# EAGLE design PTG (EAGLE 7.7.0)

## Sheet 1 of 2
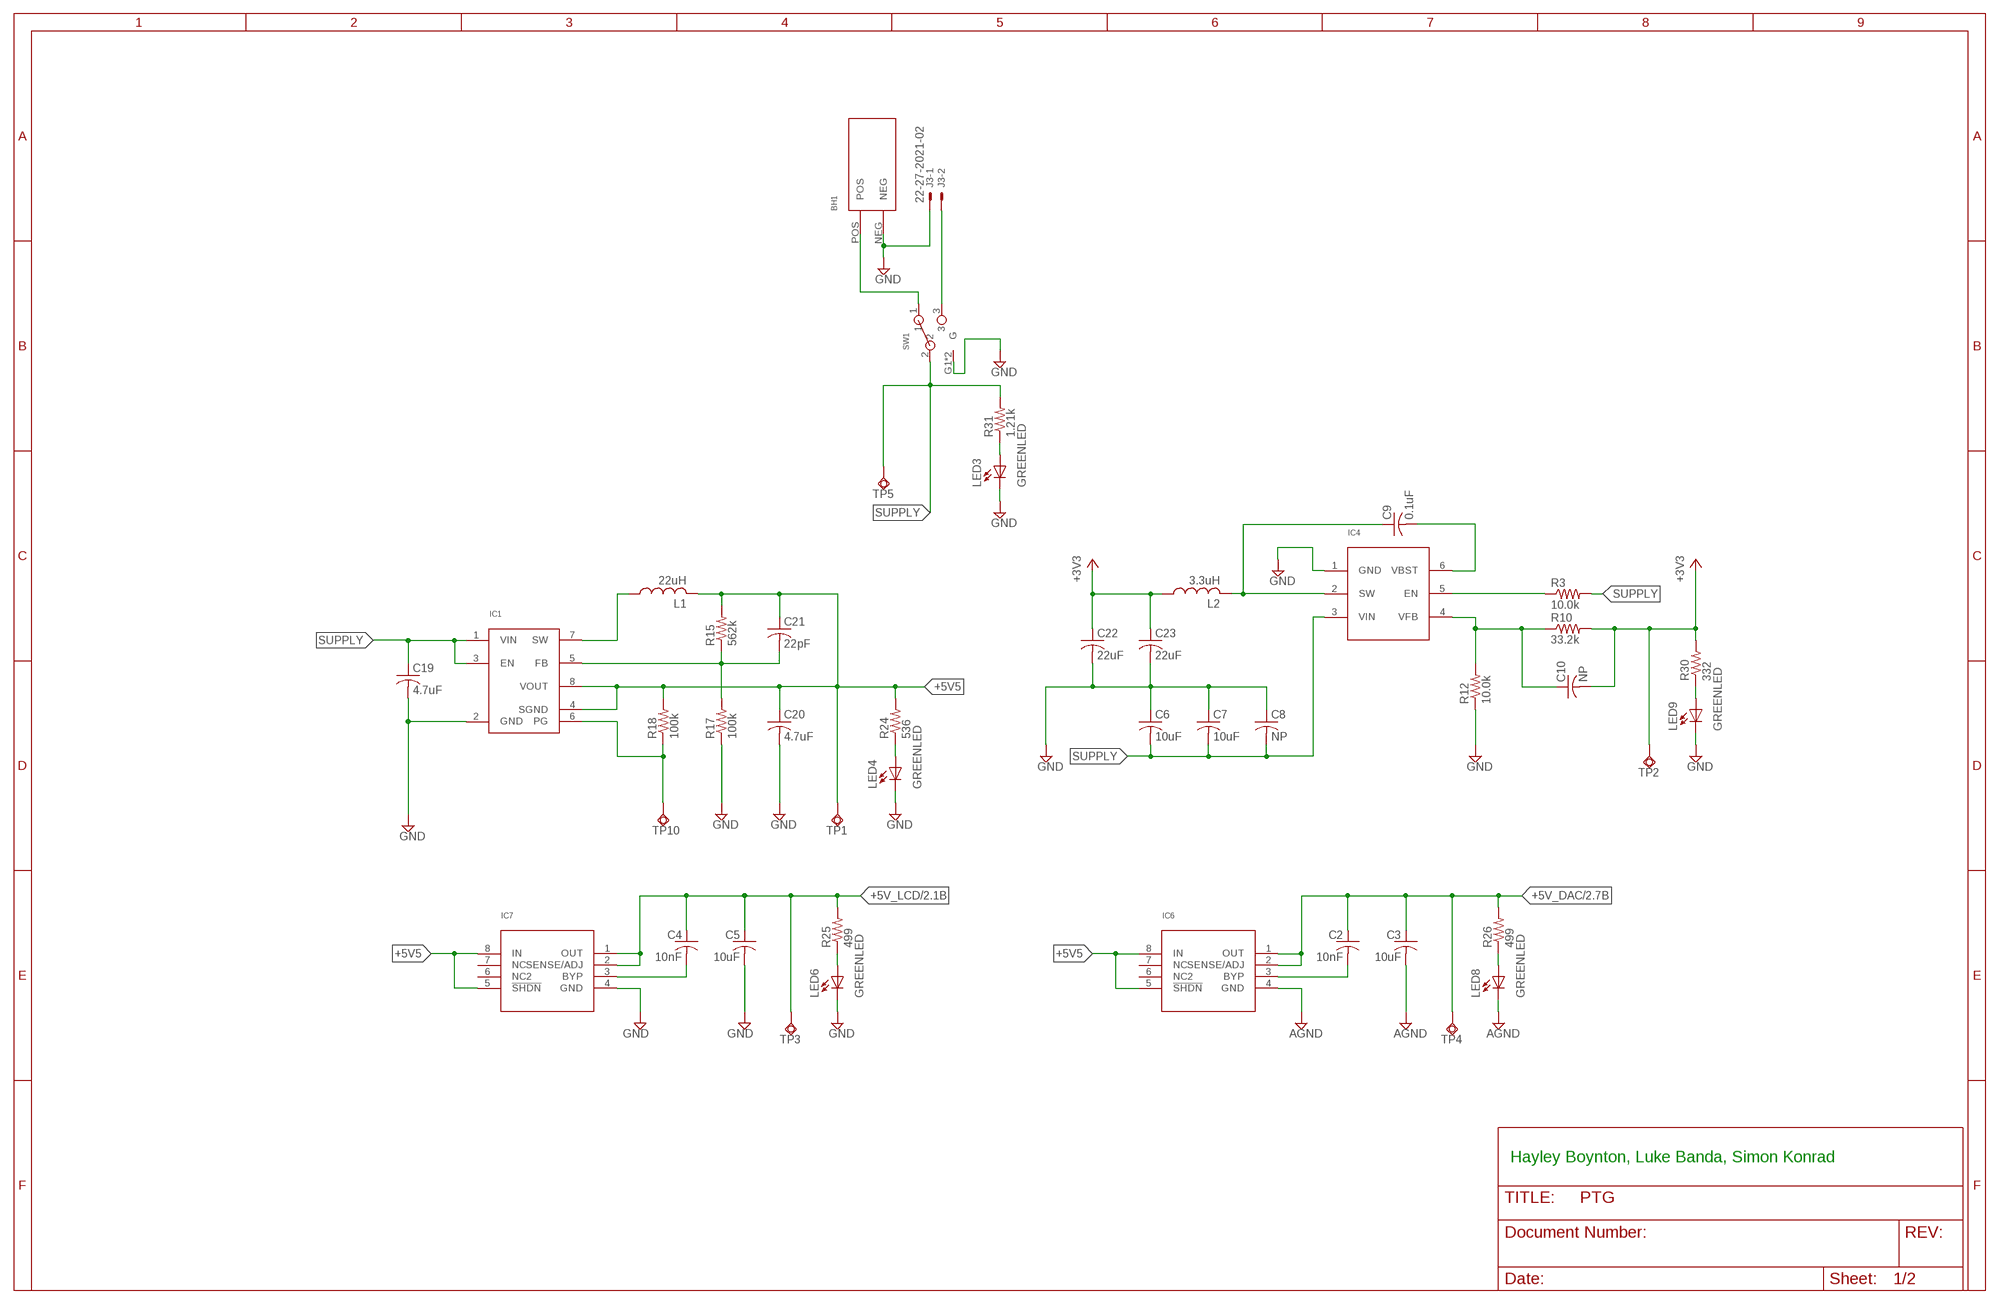
[diagram p0: schematic, sheet 1]

### Parts
BH1  BATTERY_HOLDER  [BATTERY_HOLDER]
C2  10nF  C-USC0603K  [C0603K]
C3  10uF  C-USC0805K  [C0805K]
C4  10nF  C-USC0603K  [C0603K]
C5  10uF  C-USC0805K  [C0805K]
C6  10uF  C-USC0805K  [C0805K]
C7  10uF  C-USC0805K  [C0805K]
C8  NP  C-USC0805K  [C0805K]
C9  0.1uF  C-USC0603K  [C0603K]
C10  NP  C-USC0603K  [C0603K]
C19  4.7uF  C-USC0805K  [C0805K]
C20  4.7uF  C-USC0805K  [C0805K]
C21  22pF  C-USC0603K  [C0603K]
C22  22uF  C-USC0805K  [C0805K]
C23  22uF  C-USC0805K  [C0805K]
IC1  TPS62120  [SOT23(8)]
IC4  TPS561208  [SOT6]
IC6  LT1762  [MS8]
IC7  LT1762  [MS8]
J3  22-27-2021-02  [6410-02]
L1  22uH  VLCF4020_INDUCTOR  [VLCF4020]
L2  3.3uH  VLCF4020_INDUCTOR  [VLCF4020]
LED3  GREENLED  [0805_10MGAP]
LED4  GREENLED  [0805_10MGAP]
LED6  GREENLED  [0805_10MGAP]
LED8  GREENLED  [0805_10MGAP]
LED9  GREENLED  [0805_10MGAP]
R3  10.0k  R-US_R0603  [R0603]
R10  33.2k  R-US_R0603  [R0603]
R12  10.0k  R-US_R0603  [R0603]
R15  562k  R-US_R0603  [R0603]
R17  100k  R-US_R0603  [R0603]
R18  100k  R-US_R0603  [R0603]
R24  536  R-US_R0603  [R0603]
R25  499  R-US_R0603  [R0603]
R26  499  R-US_R0603  [R0603]
R30  332  R-US_R0603  [R0603]
R31  1.21k  R-US_R0603  [R0603]
SW1  ROCKER_SWITCH  [ROCKER_SWITCH]
TP1  TPSQTP20SQD  [TP20SQD]
TP2  TPSQTP20SQD  [TP20SQD]
TP3  TPSQTP20SQD  [TP20SQD]
TP4  TPSQTP20SQD  [TP20SQD]
TP5  TPSQTP20SQD  [TP20SQD]
TP10  TPSQTP20SQD  [TP20SQD]

### Nets
+3V3: C10.2 C22.1 C23.1 L2.1 R10.2 R30.2 TP2.1(TP) TP2.TP ; also sheet 2
+5V5: C20.1 C21.1 IC1.4(SGND) IC1.8(VOUT) IC6.5(!SHDN) IC6.8(IN) IC7.5(!SHDN) IC7.8(IN) L1.2 R15.2 R18.2 R24.2 TP1.1(TP) TP1.TP
+5V_DAC: C2.1 C3.1 IC6.1(OUT) IC6.2(SENSE/ADJ) R26.2 TP4.1(TP) TP4.TP ; also sheet 2
+5V_LCD: C4.1 C5.1 IC7.1(OUT) IC7.2(SENSE/ADJ) R25.2 TP3.1(TP) TP3.TP ; also sheet 2
AGND: C3.2 IC6.4(GND) LED8.1(-) ; also sheet 2
GND: BH1.NEG C5.2 C6.1 C7.1 C8.1 C19.2 C20.2 C22.2 C23.2 IC1.2(GND) IC4.1(GND) IC7.4(GND) J3.1 LED3.1(-) LED4.1(-) LED6.1(-) LED9.1(-) R12.1 R17.1 SW1.G1(G) SW1.G2(G) ; also sheet 2
N$2: C10.1 IC4.4(VFB) R10.1 R12.2
N$4: C9.1 IC4.2(SW) L2.2
N$5: C9.2 IC4.6(VBST)
N$6: IC4.5(EN) R3.1
N$7: IC1.7(SW) L1.1
N$8: C21.2 IC1.5(FB) R15.1 R17.2
N$9: C2.2 IC6.3(BYP)
N$13: LED3.2(+) R31.1
N$22: LED4.2(+) R24.1
N$23: C4.2 IC7.3(BYP)
N$24: LED6.2(+) R25.1
N$26: LED8.2(+) R26.1
N$28: LED9.2(+) R30.1
N$29: BH1.POS SW1.1
N$30: J3.2 SW1.3
PWRGOOD: IC1.6(PG) R18.1 TP10.1(TP) TP10.TP
SUPPLY: C6.2 C7.2 C8.2 C19.1 IC1.1(VIN) IC1.3(EN) IC4.3(VIN) R3.2 R31.2 SW1.2 TP5.1(TP) TP5.TP
Unconnected: IC6.6(NC2) IC6.7(NC) IC7.6(NC2) IC7.7(NC)

### Notes on the sheet
- Hayley Boynton, Luke Banda, Simon Konrad

## Sheet 2 of 2
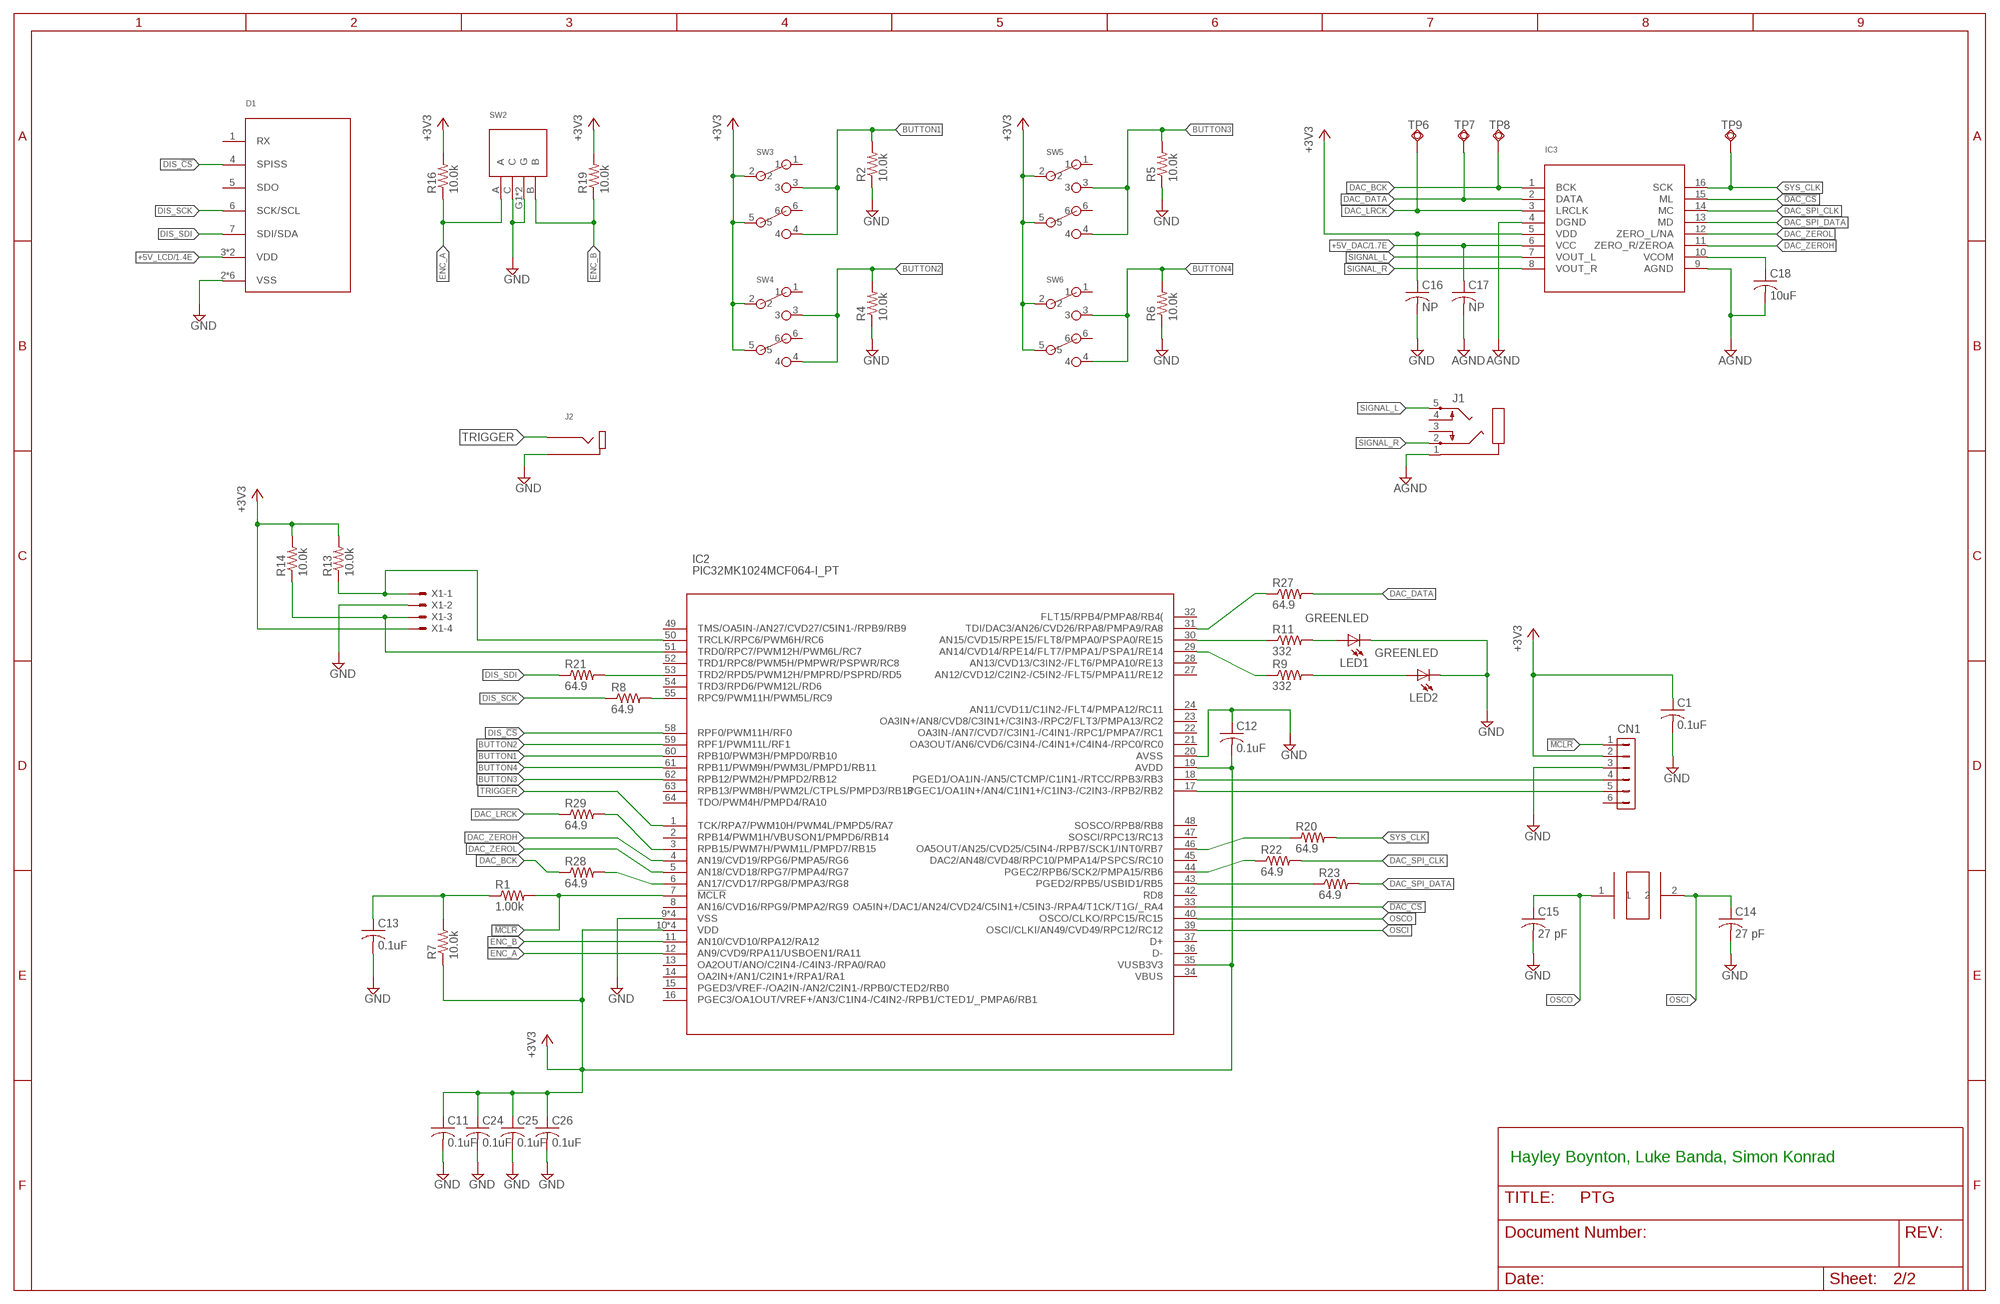
[diagram p1: schematic, sheet 2]

### Parts
C1  0.1uF  C-USC0603K  [C0603K]
C11  0.1uF  C-USC0603K  [C0603K]
C12  0.1uF  C-USC0603K  [C0603K]
C13  0.1uF  C-USC0603K  [C0603K]
C14  27 pF  C-USC0603K  [C0603K]
C15  27 pF  C-USC0603K  [C0603K]
C16  NP  C-USC0603K  [C0603K]
C17  NP  C-USC0603K  [C0603K]
C18  10uF  C-USC0805K  [C0805K]
C24  0.1uF  C-USC0603K  [C0603K]
C25  0.1uF  C-USC0603K  [C0603K]
C26  0.1uF  C-USC0603K  [C0603K]
CN1  HDR-1X6-SIP-100  [SIP-100-6V]
D1  NHD-0216K3Z-GBW-V3  [NHD-0216K3Z-FL-GBW-V3]
IC2  PIC32MK1024MCF064-I_PT  [TQFP64-10X10]
IC3  PCM1748  [SSOP]
J1  STX31005NB  [STX31005NB]
J2  RCJ-01X  [RCJ-01X]
LED1  GREENLED  [0805_10MGAP]
LED2  GREENLED  [0805_10MGAP]
R1  1.00k  R-US_R0603  [R0603]
R2  10.0k  R-US_R0603  [R0603]
R4  10.0k  R-US_R0603  [R0603]
R5  10.0k  R-US_R0603  [R0603]
R6  10.0k  R-US_R0603  [R0603]
R7  10.0k  R-US_R0603  [R0603]
R8  64.9  R-US_R0603  [R0603]
R9  332  R-US_R0603  [R0603]
R11  332  R-US_R0603  [R0603]
R13  10.0k  R-US_R0603  [R0603]
R14  10.0k  R-US_R0603  [R0603]
R16  10.0k  R-US_R0603  [R0603]
R19  10.0k  R-US_R0603  [R0603]
R20  64.9  R-US_R0603  [R0603]
R21  64.9  R-US_R0603  [R0603]
R22  64.9  R-US_R0603  [R0603]
R23  64.9  R-US_R0603  [R0603]
R27  64.9  R-US_R0603  [R0603]
R28  64.9  R-US_R0603  [R0603]
R29  64.9  R-US_R0603  [R0603]
SW2  ENCODER  [EC12E24204A7]
SW3  MHPS2273N  [MHPS2273N]
SW4  MHPS2273N  [MHPS2273N]
SW5  MHPS2273N  [MHPS2273N]
SW6  MHPS2273N  [MHPS2273N]
TP6  TPSQTP20SQD  [TP20SQD]
TP7  TPSQTP20SQD  [TP20SQD]
TP8  TPSQTP20SQD  [TP20SQD]
TP9  TPSQTP20SQD  [TP20SQD]
X1  22-23-2041  [22-23-2041]
Y1  EXTERNALCRYSTAL  [XTAL500X320X130N]

### Nets
!DAC_CS: IC2.33(OA5IN+/DAC1/AN24/CVD24/C5IN1+/C5IN3-/RPA4/T1CK/T1G/_RA4) IC3.15(ML)
!MCLR: CN1.1 IC2.7(!MCLR) R1.2
+3V3: C1.1 C11.1 C12.2 C16.1 C24.1 C25.1 C26.1 CN1.2 IC2.10(VDD) IC2.19(AVDD) IC2.26(VDD) IC2.35(VUSB3V3) IC2.38(VDD) IC2.57(VDD) IC3.5(VDD) R7.1 R13.2 R14.2 R16.2 R19.2 SW3.2 SW3.5 SW4.2 SW4.5 SW5.2 SW5.5 SW6.2 SW6.5 X1.4 ; also sheet 1
+5V_DAC: C17.1 IC3.6(VCC) ; also sheet 1
+5V_LCD: D1.3(VDD) D1.9(VDD) ; also sheet 1
AGND: C17.2 C18.2 IC3.4(DGND) IC3.9(AGND) J1.1 ; also sheet 1
BUTTON1: IC2.60(RPB10/PWM3H/PMPD0/RB10) R2.2 SW3.3 SW3.4
BUTTON2: IC2.59(RPF1/PWM11L/RF1) R4.2 SW4.3 SW4.4
BUTTON3: IC2.62(RPB12/PWM2H/PMPD2/RB12) R5.2 SW5.3 SW5.4
BUTTON4: IC2.61(RPB11/PWM9H/PWM3L/PMPD1/RB11) R6.2 SW6.3 SW6.4
DAC_BCK: IC3.1(BCK) R28.1 TP8.1(TP) TP8.TP
DAC_DATA: IC3.2(DATA) R27.2 TP7.1(TP) TP7.TP
DAC_LRCK: IC3.3(LRCLK) R29.1 TP6.1(TP) TP6.TP
DAC_SPI_CLK: IC3.14(MC) R22.2
DAC_SPI_DATA: IC3.13(MD) R23.2
DAC_ZEROH: IC2.4(AN19/CVD19/RPG6/PMPA5/RG6) IC3.11(ZERO_R/ZEROA)
DAC_ZEROL: IC2.5(AN18/CVD18/RPG7/PMPA4/RG7) IC3.12(ZERO_L/NA)
DIS_!CS: D1.4(SPISS) IC2.58(RPF0/PWM11H/RF0)
DIS_SCK: D1.6(SCK/SCL) R8.1
DIS_SDI: D1.7(SDI/SDA) R21.1
ENC_A: IC2.12(AN9/CVD9/RPA11/USBOEN1/RA11) R16.1 SW2.A
ENC_B: IC2.11(AN10/CVD10/RPA12/RA12) R19.1 SW2.B
GND: C1.2 C11.2 C12.1 C13.2 C14.2 C15.2 C16.2 C24.2 C25.2 C26.2 CN1.3 D1.2(VSS) D1.8(VSS) D1.G1(VSS) D1.G2(VSS) D1.G3(VSS) D1.G4(VSS) IC2.9(VSS) IC2.20(AVSS) IC2.25(VSS) IC2.41(VSS) IC2.56(VSS) J2.1 J2.3 J2.4 LED1.1(-) LED2.1(-) R2.1 R4.1 R5.1 R6.1 SW2.C SW2.G1(G) SW2.G2(G) X1.2 ; also sheet 1
N$1: IC2.31(TDI/DAC3/AN26/CVD26/RPA8/PMPA9/RA8) R27.1
N$3: IC2.55(RPC9/PWM11H/PWM5L/RC9) R8.2
N$10: IC2.53(TRD2/RPD5/PWM12H/PMPRD/PSPRD/RD5) R21.2
N$11: IC2.30(AN15/CVD15/RPE15/FLT8/PMPA0/PSPA0/RE15) R11.1
N$12: LED1.2(+) R11.2
N$14: IC2.46(OA5OUT/AN25/CVD25/C5IN4-/RPB7/SCK1/INT0/RB7) R20.1
N$15: LED2.2(+) R9.2
N$16: CN1.5 IC2.17(PGEC1/OA1IN+/AN4/C1IN1+/C1IN3-/C2IN3-/RPB2/RB2)
N$17: IC2.29(AN14/CVD14/RPE14/FLT7/PMPA1/PSPA1/RE14) R9.1
N$18: C13.1 R1.1 R7.2
N$19: C18.1 IC3.10(VCOM)
N$20: IC2.3(RPB15/PWM7H/PWM1L/PMPD7/RB15) R29.2
N$21: IC2.44(PGEC2/RPB6/SCK2/PMPA15/RB6) R22.1
N$25: CN1.4 IC2.18(PGED1/OA1IN-/AN5/CTCMP/C1IN1-/RTCC/RPB3/RB3)
N$27: IC2.43(PGED2/RPB5/USBID1/RB5) R23.1
N$31: IC2.6(AN17/CVD17/RPG8/PMPA3/RG8) R28.2
OSCI: C14.1 IC2.39(OSCI/CLKI/AN49/CVD49/RPC12/RC12) Y1.2
OSCO: C15.1 IC2.40(OSCO/CLKO/RPC15/RC15) Y1.1
SIGNAL_L: IC3.7(VOUT_L) J1.5
SIGNAL_R: IC3.8(VOUT_R) J1.2
SYS_CLK: IC3.16(SCK) R20.2 TP9.1(TP) TP9.TP
TRIGGER: IC2.1(TCK/RPA7/PWM10H/PWM4L/PMPD5/RA7) J2.2
UART-RX: IC2.50(TRCLK/RPC6/PWM6H/RC6) R13.1 X1.1
UART-TX: IC2.51(TRD0/RPC7/PWM12H/PWM6L/RC7) R14.1 X1.3
Unconnected: CN1.6 D1.1(RX) D1.5(SDO) IC2.2(RPB14/PWM1H/VBUSON1/PMPD6/RB14) IC2.8(AN16/CVD16/RPG9/PMPA2/RG9) IC2.13(OA2OUT/ANO/C2IN4-/C4IN3-/RPA0/RA0) IC2.14(OA2IN+/AN1/C2IN1+/RPA1/RA1) IC2.15(PGED3/VREF-/OA2IN-/AN2/C2IN1-/RPB0/CTED2/RB0) IC2.16(PGEC3/OA1OUT/VREF+/AN3/C1IN4-/C4IN2-/RPB1/CTED1/_PMPA6/RB1) IC2.21(OA3OUT/AN6/CVD6/C3IN4-/C4IN1+/C4IN4-/RPC0/RC0) IC2.22(OA3IN-/AN7/CVD7/C3IN1-/C4IN1-/RPC1/PMPA7/RC1) IC2.23(OA3IN+/AN8/CVD8/C3IN1+/C3IN3-/RPC2/FLT3/PMPA13/RC2) IC2.24(AN11/CVD11/C1IN2-/FLT4/PMPA12/RC11) IC2.27(AN12/CVD12/C2IN2-/C5IN2-/FLT5/PMPA11/RE12) IC2.28(AN13/CVD13/C3IN2-/FLT6/PMPA10/RE13) IC2.32(FLT15/RPB4/PMPA8/RB4() IC2.34(VBUS) IC2.36(D-) IC2.37(D+) IC2.42(RD8) IC2.45(DAC2/AN48/CVD48/RPC10/PMPA14/PSPCS/RC10) IC2.47(SOSCI/RPC13/RC13) IC2.48(SOSCO/RPB8/RB8) IC2.49(TMS/OA5IN-/AN27/CVD27/C5IN1-/RPB9/RB9) IC2.52(TRD1/RPC8/PWM5H/PMPWR/PSPWR/RC8) IC2.54(TRD3/RPD6/PWM12L/RD6) IC2.63(RPB13/PWM8H/PWM2L/CTPLS/PMPD3/RB13) IC2.64(TDO/PWM4H/PMPD4/RA10) J1.3 J1.4 SW3.1 SW3.6 SW4.1 SW4.6 SW5.1 SW5.6 SW6.1 SW6.6

### Notes on the sheet
- Hayley Boynton, Luke Banda, Simon Konrad

## Library data of the parts
BH1 = Batt_Holder:BATTERY_HOLDER: 9V Battery Holder Through Holes 4 Mounting Holes
C1-C26 = rcl:C-US: CAPACITOR, American symbol
CN1 = con-hdrs40:HDR-1X6: HEADER CONNECTOR
D1 = NHD-0216K3Z-FL-GBW-V3:NHD-0216K3Z-GBW-V3: NHD-0216K3Z-GBW-V3 Serial Liquid Crystal Display Module 2 Lines x 16 Characters 5 V input
IC1 = TPS62120:TPS62120: TPS62120 2-15V Input 1.2-5.5V Output Highly Efficient Buck Converter DCN PKG
IC2 = PIC_FORREAL:PIC32MK1024MCF064-I_PT: MICROCHIP - PIC32MK1024MCF064-I/PT - MCU, 32BIT, PIC32, 120MHZ, TQFP-64 Source: Datasheet <http://ww1.microchip.com/downloads/en/DeviceDoc/60001402D.pdf>
IC3 = PCM1748:PCM1748: PCM1748 24 Bit 96kHz Sampling DAC 5V Analog input 3.3V Digital Input
IC4 = TPS561208:TPS561208: TPS561208 5V input 3V3 output Step Down Voltage Regulator
IC6 IC7 = LT1762:LT1762: LT1762 150mA Low Noise LDO Regulator 1.8-20V Input 1.22-20V Output
J1 = STX31005NB:STX31005NB: STX31005NB 3.5mm Stereo Jack Single Pole Double Throw
J2 = RCJ-01X:RCJ-01X: RCJ-01X RCA Port
J3 = con-molex:22-?-02: CONNECTOR wire to board 2.54 mm (.1 inch) pitch header; OC_FARNELL: unknown; OC_NEWARK: unknown
L1 L2 = VLCF4020Inductor:VLCF4020_INDUCTOR: VLCF4020 Type Inductors for Power Circuits TDK
LED1-LED4 LED6 LED8 LED9 = GreenLED:GREENLED
R1 R3 R7 R10 R12 R15 R17 R18 R24-R26 R30 R31 = resistor:R-US_: RESISTOR, American symbol
R2 R4-R6 R8 R9 R11 R13 R14 R16 R19-R23 R27-R29 = rcl:R-US_: RESISTOR, American symbol
SW1 = Rocker_Sw:ROCKER_SWITCH: 3 Position Rocker Switch On - Off - On Max 28V DC @5A Side Facing Switch
SW2 = Encoder:ENCODER: EC12E24204A7 12 mm Insulated Shaft Encoder
SW3-SW6 = Button:MHPS2273N: MHPS2273N Momentary Double Pole Double Throw Button 100mA @30V DC
TP1-TP10 = testpad:TPSQ: Test pad
X1 = 22-23-2041:22-23-2041: .100" (2.54mm) Center Header - 4 Pin; AVAILABILITY: Good; DESCRIPTION: KK® 254 Solid Header, Vertical, with Friction Lock, 4 Circuits, Tin _Sn_ Plating; MF: Molex; MP: 22-23-2041; PACKAGE: None; PRICE: 0.14 USD
Y1 = XTAL500X320X130N:EXTERNALCRYSTAL

## Board
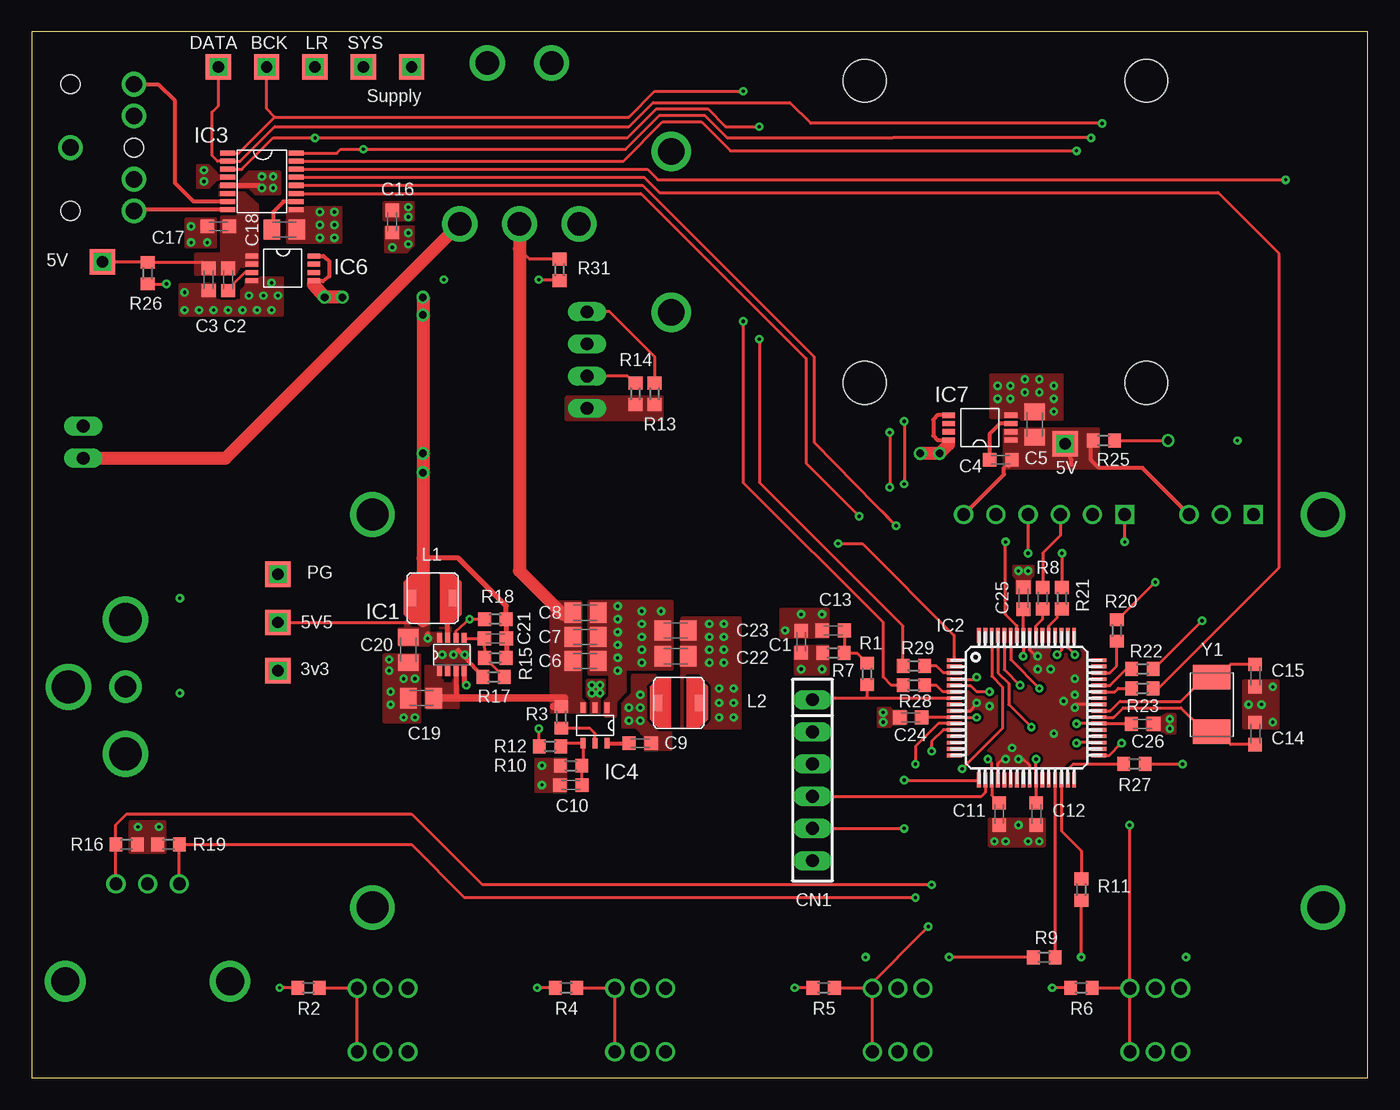
[diagram p2: board, top side]
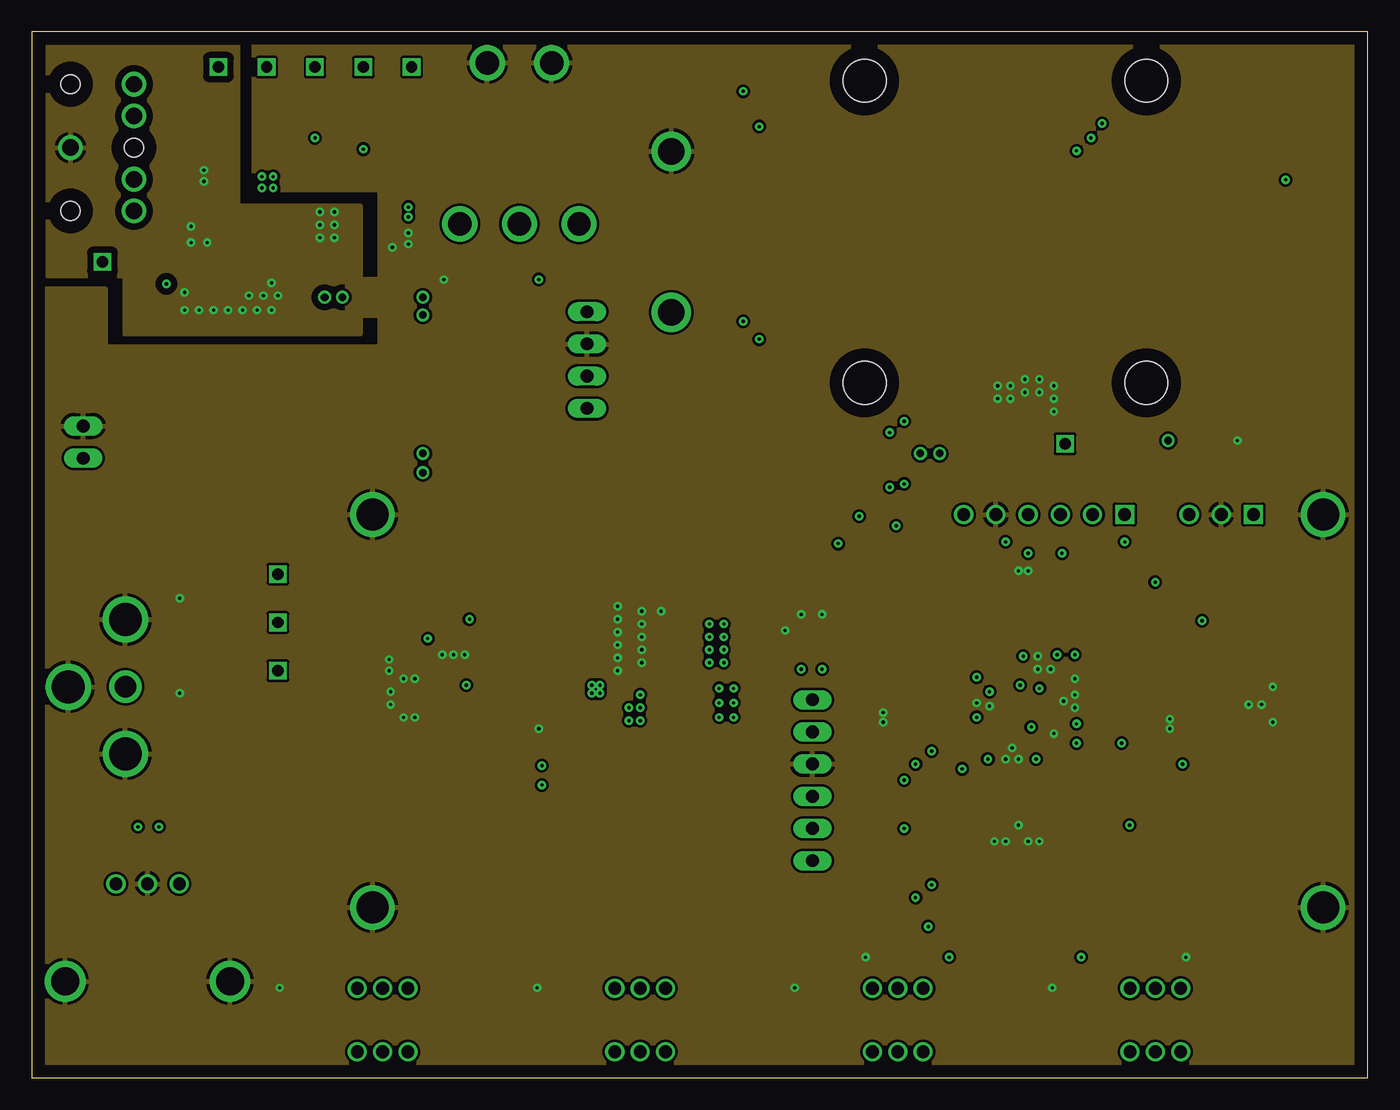
[diagram p3: board, inner layer GND]
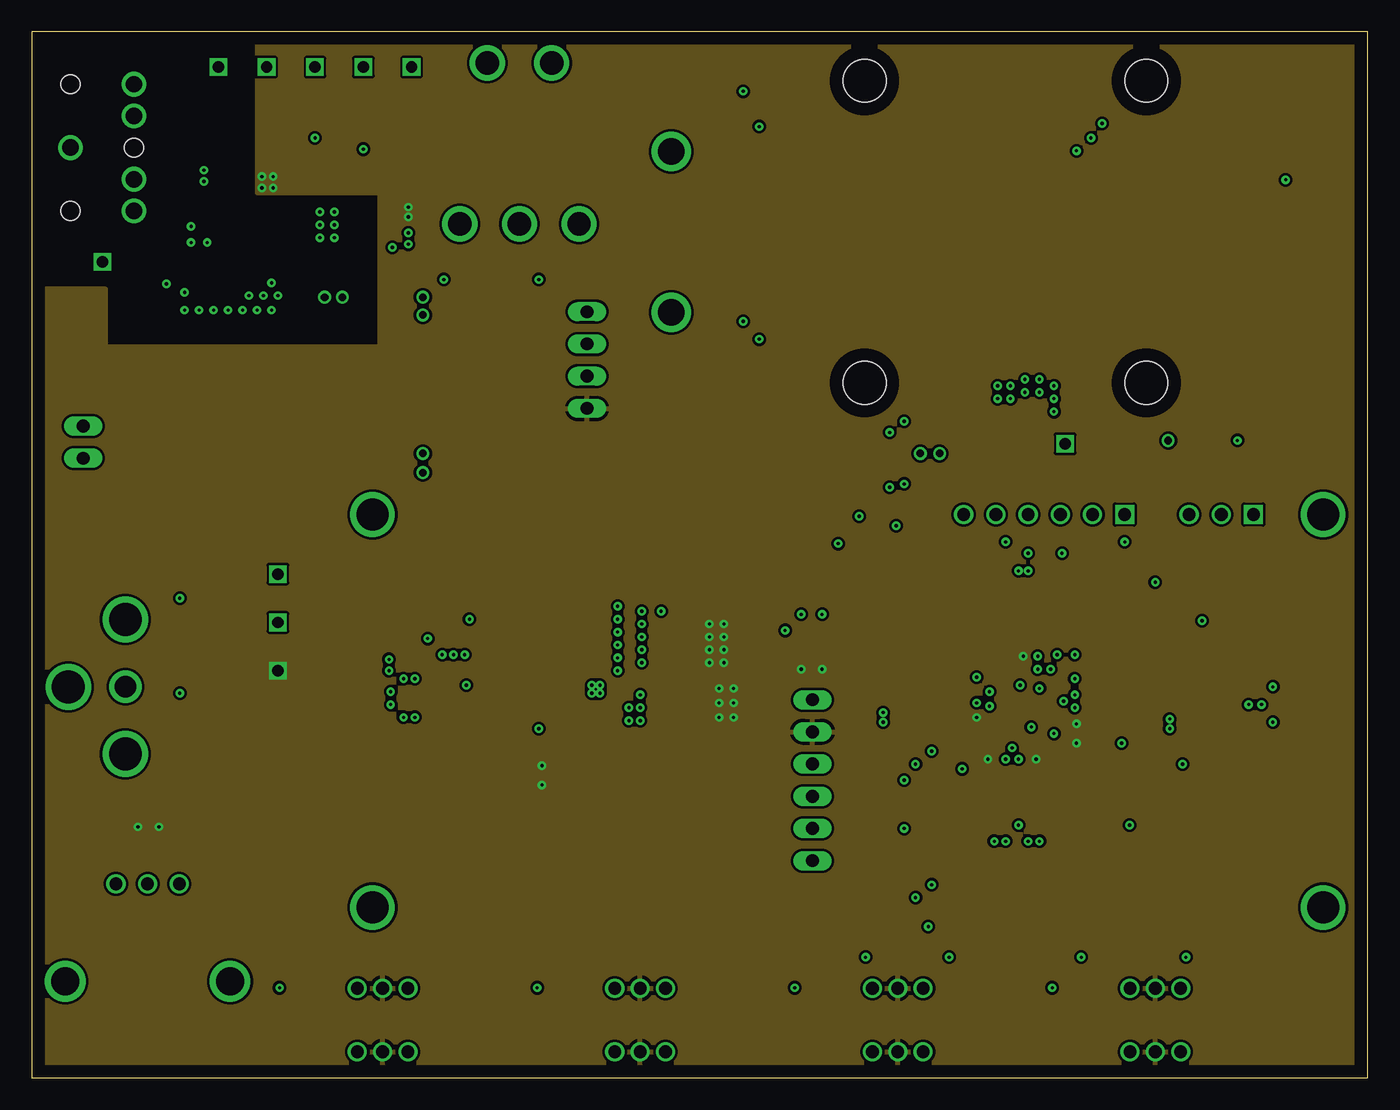
[diagram p4: board, inner layer PWR]
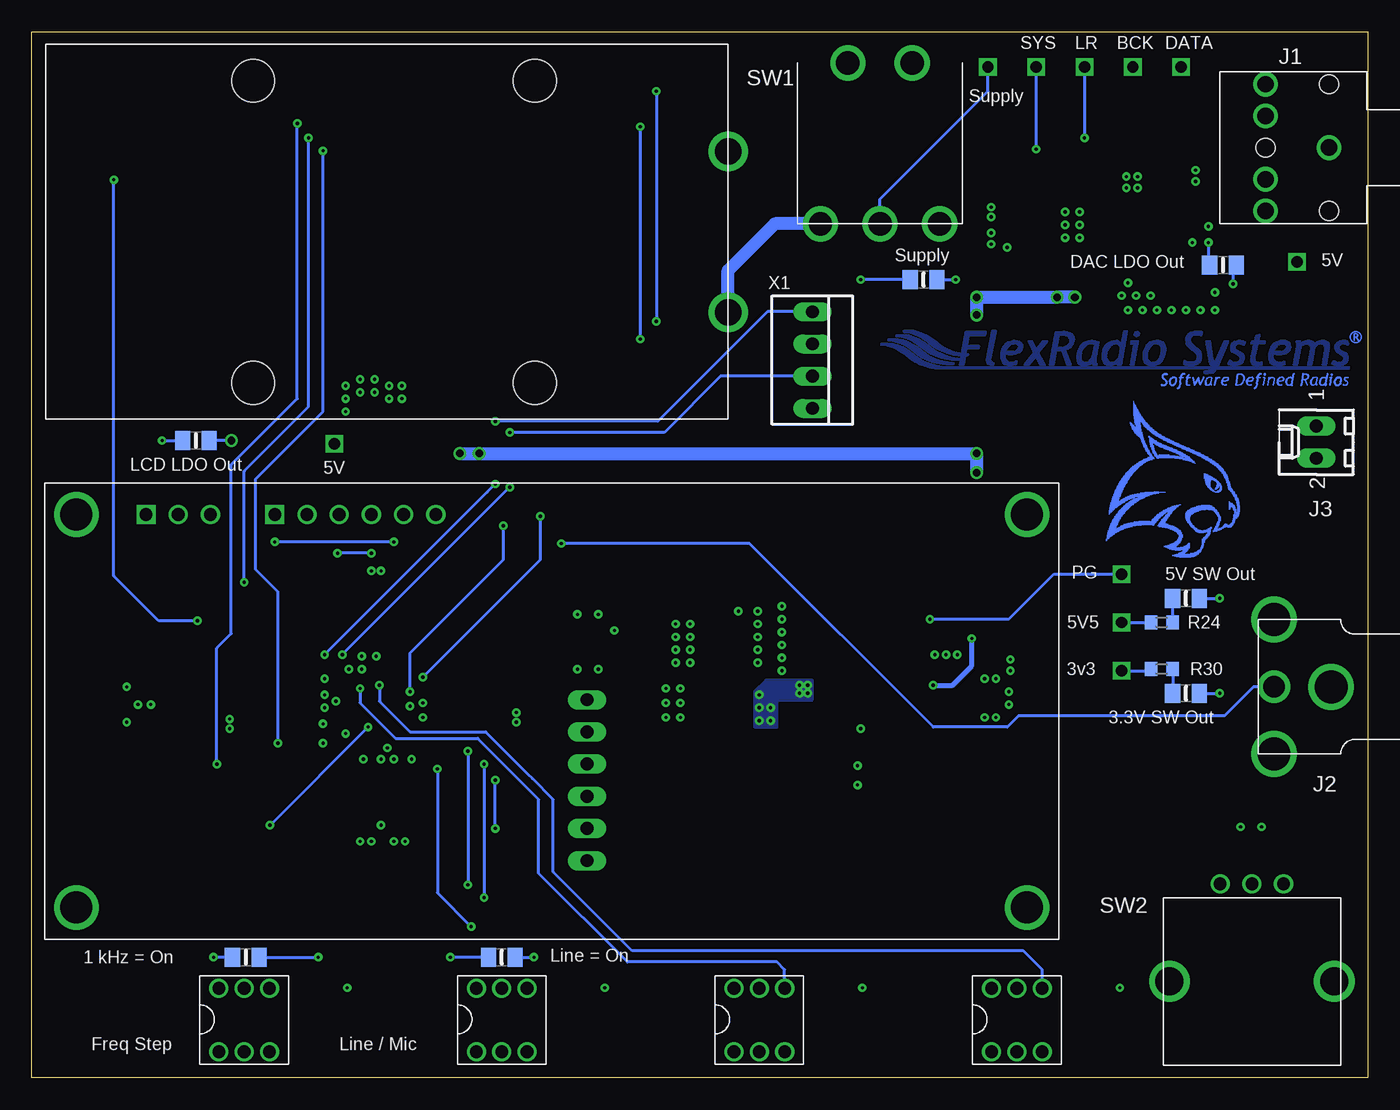
[diagram p5: board, bottom side, seen from below]

Size 105.41 x 82.55 mm. Coordinates in mm from the lower left corner, seen from the top.
Outline: 0,0 105.41,0 105.41,82.55 0,82.55 0,0
Copper layers (1*2*15*16): Top 0.035559375mm / dielectric 9mil / GND 0.035559375mm / dielectric 40mil / PWR 0.035559375mm / dielectric 9mil / Bottom 0.035559375mm
Design rules "default *": minimum track width 10mil, minimum drill 8mil, track to track 8mil, track to pad 8mil, pad to pad 8mil, via to via 8mil, smd to smd 8mil, copper to edge 40mil, drill to drill 8mil, minimum pad ring 10mil, minimum via ring 8mil, stop-mask expansion 4mil, vias tented up to drill 0mil, thermal gap 10mil

### Footprints (pad centres in the part's own frame; a part is rotated, then mirrored left to right if it is on the bottom)
BATTERY_HOLDER = drill 2.1: NEG -27,-6.565; POS -27,6.135 | hole 3.4: -11.76,-12.13; 10.47,-12.13; 10.47,11.7; -11.76,11.7
C0603K = smd 1.05 x 1.08: 1 -0.875,0; 2 0.875,0
C0805K = smd 1.3 x 1.6: 1 -1,0; 2 1,0
SIP-100-6V = drill 1.016 long: 1 -6.35,0; 2 -3.81,0; 3 -1.27,0; 4 1.27,0; 5 3.81,0; 6 6.35,0
NHD-0216K3Z-FL-GBW-V3 = drill 1 square: 1 -32,15.5; 4 -21.84,15.5 | drill 1: 2 -29.46,15.5; 3 -26.92,15.5; 5 -19.3,15.5; 6 -16.76,15.5; 7 -14.22,15.5; 8 -11.68,15.5; 9 -9.14,15.5 | drill 2.5: G1 -37.5,15.5; G2 37.5,15.5; G3 37.5,-15.5; G4 -37.5,-15.5
SOT23(8) = smd 0.4 x 0.8: 1 -0.975,-1.3; 2 -0.325,-1.3; 3 0.325,-1.3; 4 0.975,-1.3; 5 0.975,1.3; 6 0.325,1.3; 7 -0.325,1.3; 8 -0.975,1.3
TQFP64-10X10 = smd 1.2 x 0.3: 1 -5.7,3.75; 2 -5.7,3.25; 3 -5.7,2.75; 4 -5.7,2.25; 5 -5.7,1.75; 6 -5.7,1.25; 7 -5.7,0.75; 8 -5.7,0.25; 9 -5.7,-0.25; 10 -5.7,-0.75; 11 -5.7,-1.25; 12 -5.7,-1.75; 13 -5.7,-2.25; 14 -5.7,-2.75; 15 -5.7,-3.25; 16 -5.7,-3.75; 33 5.7,-3.75; 34 5.7,-3.25; 35 5.7,-2.75; 36 5.7,-2.25; 37 5.7,-1.75; 38 5.7,-1.25; 39 5.7,-0.75; 40 5.7,-0.25; 41 5.7,0.25; 42 5.7,0.75; 43 5.7,1.25; 44 5.7,1.75; 45 5.7,2.25; 46 5.7,2.75; 47 5.7,3.25; 48 5.7,3.75 | smd 0.3 x 1.2: 17 -3.75,-5.7; 18 -3.25,-5.7; 19 -2.75,-5.7; 20 -2.25,-5.7; 21 -1.75,-5.7; 22 -1.25,-5.7; 23 -0.75,-5.7; 24 -0.25,-5.7; 25 0.25,-5.7; 26 0.75,-5.7; 27 1.25,-5.7; 28 1.75,-5.7; 29 2.25,-5.7; 30 2.75,-5.7; 31 3.25,-5.7; 32 3.75,-5.7; 49 3.75,5.7; 50 3.25,5.7; 51 2.75,5.7; 52 2.25,5.7; 53 1.75,5.7; 54 1.25,5.7; 55 0.75,5.7; 56 0.25,5.7; 57 -0.25,5.7; 58 -0.75,5.7; 59 -1.25,5.7; 60 -1.75,5.7; 61 -2.25,5.7; 62 -2.75,5.7; 63 -3.25,5.7; 64 -3.75,5.7
SSOP = smd 0.4 x 1.2: 1 -2.223,-2.7; 2 -1.587,-2.7; 3 -0.953,-2.7; 4 -0.318,-2.7; 5 0.318,-2.7; 6 0.953,-2.7; 7 1.587,-2.7; 8 2.223,-2.7; 9 2.223,2.7; 10 1.587,2.7; 11 0.953,2.7; 12 0.318,2.7; 13 -0.318,2.7; 14 -0.953,2.7; 15 -1.587,2.7; 16 -2.223,2.7
SOT6 = smd 0.4 x 0.8: 1 -0.95,-1.4; 2 0,-1.4; 3 0.95,-1.4; 4 0.95,1.4; 5 0,1.4; 6 -0.95,1.4
MS8 = smd 0.4 x 1: 1 -0.975,-2.45; 2 -0.325,-2.45; 3 0.325,-2.45; 4 0.975,-2.45; 5 0.975,2.45; 6 0.325,2.45; 7 -0.325,2.45; 8 -0.975,2.45
STX31005NB = drill 1.3: 1 -1,0; 2 4,5; 3 4,2.5; 4 4,-2.5; 5 4,-5 | hole 1.5: -1,-5; -1,5; 4,0
RCJ-01X = drill 2.6: 1 1.5,0; 3 6,5.3; 4 6,-5.3 | drill 1.7: 2 6,0
6410-02 = drill 1.016 long: 1 1.27,0; 2 -1.27,0
VLCF4020 = smd 1.27 x 0.635: 1 0,1.6; 2 0,-1.6
0805_10MGAP = smd 1.2 x 1.5: 1 -1.05,0; 2 1.05,0
R0603 = smd 1 x 1.1: 1 -0.85,0; 2 0.85,0
ROCKER_SWITCH = drill 1.85: 1 -4.7,-6.4; 2 0,-6.4; 3 4.7,-6.4; G1 -2.54,6.3; G2 2.54,6.3
EC12E24204A7 = drill 1: A -2.5,-7.7; B 2.5,-7.7; C 0,-7.7 | drill 2.2: G1 -6.5,0; G2 6.5,0
MHPS2273N = drill 1: 1 -2,-2.5; 2 0,-2.5; 3 2,-2.5; 4 2,2.5; 5 0,2.5; 6 -2,2.5
TP20SQD = drill 0.889 square: 1 0,0 | smd 2 x 2: TP 0,0
22-23-2041 = drill 1 long: 1 -3.81,0; 2 -1.27,0; 3 1.27,0; 4 3.81,0
XTAL500X320X130N = smd 1.95 x 2.95: 1 -2.15,0; 2 2.15,0

### Placement (x,y rotation side)
BH1  77.47,66.55 180 bottom
C1  60.71,34.42 90 top
C2  15.49,62.99 270 top
C3  10nF  [C0603K]  13.97,62.99 270 top
C4  76.45,48.77 180 top
C5  79.12,51.56 90 top
C6  43.69,32.89 180 top
C7  43.69,34.8 180 top
C8  43.69,36.7 180 top
C9  48.01,26.42 180 top
C10  42.55,23.11 180 top
C11  76.33,20.83 270 top
C12  79.25,20.83 90 top
C13  63.25,35.31 180 top
C14  96.52,27.18 90 top
C15  96.52,31.75 270 top
C16  28.45,67.56 270 top
C17  14.73,67.18 180 top
C18  19.94,66.93 0 top
C19  30.73,29.97 180 top
C20  29.72,33.78 270 top
C21  36.58,34.67 180 top
C22  50.8,33.27 180 top
C23  50.8,35.31 180 top
C24  69.34,28.45 180 top
C25  78.23,37.85 90 top
C26  87.63,27.94 0 top
CN1  61.59,23.5 270 top
D1  64.39,28.96 0 bottom
IC1  33.15,33.4 0 top
IC2  78.49,29.21 0 top
IC3  18.16,70.74 270 top
IC4  44.45,27.81 180 top
IC6  19.81,63.88 270 top
IC7  74.8,51.31 90 top
J1  4.06,73.41 180 bottom
J2  1.4,30.86 180 bottom
J3  4.06,50.16 90 bottom
L1  31.62,37.85 270 top
L2  51.05,29.59 270 top
LED1  88.52,9.53 0 bottom
LED2  68.33,9.53 180 bottom
LED3  35.05,62.99 180 bottom
LED4  14.35,37.85 180 bottom
LED6  92.46,50.29 0 bottom
LED8  11.43,64.14 0 bottom
LED9  14.35,30.35 180 bottom
R1  65.91,31.88 270 top
R2  21.84,7.11 0 top
R3  41.78,28.45 90 top
R4  42.16,7.11 0 top
R5  62.48,7.11 0 top
R6  82.8,7.11 0 top
R7  63.25,33.53 0 top
R8  79.76,37.85 270 top
R9  79.88,9.53 180 top
R10  42.55,24.64 180 top
R11  82.8,14.86 270 top
R12  40.89,26.16 0 top
R13  49.15,53.98 270 top
R14  47.62,53.98 270 top
R15  36.58,33.15 0 top
R16  7.49,18.41 0 top
R17  36.45,31.62 0 top
R18  36.58,36.2 0 top
R19  10.79,18.41 180 top
R20  85.6,35.31 90 top
R21  81.28,37.85 270 top
R22  87.63,32.26 0 top
R23  87.63,30.73 0 top
R24  16.26,35.94 180 bottom
R25  84.58,50.29 180 top
R26  9.14,63.5 90 top
R27  87,24.77 0 top
R28  69.6,30.99 0 top
R29  69.6,32.51 0 top
R30  16.26,32.26 180 bottom
R31  41.66,63.75 90 top
SW1  38.48,73.79 0 bottom
SW2  9.14,7.62 180 bottom
SW3  27.69,4.57 0 bottom
SW4  48.01,4.57 0 bottom
SW5  68.33,4.57 0 bottom
SW6  88.65,4.57 0 bottom
TP1  19.43,35.94 0 top
TP2  19.43,32.13 0 top
TP3  81.53,50.04 0 top
TP4  5.59,64.39 0 top
TP5  29.97,79.76 0 top
TP6  22.35,79.76 0 top
TP7  14.73,79.76 0 top
TP8  18.54,79.76 0 top
TP9  26.16,79.76 0 top
TP10  19.43,39.75 0 top
X1  43.81,56.64 270 bottom
Y1  93.09,29.46 270 top

### Tracks (layer width: path | path; a pad name or v marks a point on that pad's centre or on a via)
!DAC_CS  (via drill 0.25)
  Top 0.254: IC3.15 46.67,72.33 49.78,75.44 52.83,75.44 55.12,73.15 v82.42,73.15 | IC2.33 85.02,25.46 v85.98,26.42
  Bottom 0.254: v85.98,26.42 85.98,38.35 87.76,40.13 87.76,47.24 82.42,52.58 v82.42,73.15
!MCLR
  Top 0.254: IC2.7 65.79,29.96 | 65.79,29.96 61.71,29.96 CN1.1 | R1.2 65.91,30.09 65.79,29.96
+3V3  (via drill 0.25)
  Top 0.254: v74.55,28.45 74.68,28.46 IC2.10 C24.1 | v79.25,25.15 79.24,25.26 IC2.26 79.24,21.71 C12.2 | IC2.35 82.34,26.46 v82.42,26.42 | v82.42,27.94 82.32,27.96 IC2.38 86.73,27.96 C26.1 | C25.1 IC2.57 v78.24,33.28 v78.23,33.27 | C11.1 75.74,22.29 IC2.19 75.74,24.85 v75.44,25.15
  Top 0.406: IC3.5 17.97,70.42 v18.16,70.23
  Bottom 0.254: TP2.TP 17.23,32.13 R30.2
  other vias: 54.23,28.45 55.37,28.45 55.37,29.59 54.23,29.59 54.23,30.73 55.37,30.73 54.61,32.77 53.47,32.77 53.47,33.78 53.47,34.8 53.47,35.81 54.61,35.81 54.61,34.8 54.61,33.78 40.26,24.64 40.26,23.11 8.38,19.81 10.03,19.81 18.16,71.12 19.05,71.12 19.05,70.23 29.72,68.71 29.72,67.94 62.36,32.26 60.71,32.26
  pour PWR: 0,0 105.41,0 105.41,82.55 17.78,82.8 17.78,69.85 27.43,69.85 27.43,57.66 5.84,57.66 5.84,62.23 0,62.23
  pour Top (rank 2, no thermals): 51.31,36.32 55.88,36.32 55.88,27.56 51.31,27.56
  pour Top (rank 2, no thermals): 42.16,25.15 39.75,25.15 39.75,22.61 42.16,22.61
  pour Top (rank 2, no thermals): 7.75,20.19 7.75,17.78 10.54,17.78 10.54,20.19
  pour Top (rank 2, no thermals): 14.86,70.61 16.26,70.61 17.14,71.5 19.56,71.5 19.56,69.72 17.65,69.72 17.14,70.23 14.86,70.23
  pour Top (rank 2, no thermals): 27.81,69.09 30.1,69.09 30.1,67.69 27.81,67.69
  pour Top (rank 2, no thermals): 49.78,53.72 42.16,53.72 42.16,51.94 49.78,51.94
  pour Top (rank 2, no thermals): 60.2,34.04 60.2,31.88 62.87,31.88 62.87,34.04
+5V5  (via drill 0.25, 0.61)
  Top 0.254: 29.96,34.54 C20.1 | TP1.TP 30.73,35.94 30.86,36.07
  Top 0.305: 30.86,36.96 30.86,36.31 | IC7.5 71.46,52.28 71.12,51.94 71.12,50.67 71.46,50.33 IC7.8 | IC6.8 23.03,64.86 23.5,64.39 23.5,63.25 22.99,62.87 22.3,62.87 IC6.5
  Top 0.406: IC1.4 34.12,31.16 v34.29,30.99 | v31.24,34.67 31.24,35.05 | IC6.5 22.26,62.57 22.23,62.61 | 72.35,50 IC7.8 | 30.86,41.02 33.66,41.02 37.43,37.25 R18.2 37.43,34.7 C21.1 37.45,33.17 R15.2
  Top 1.016: v30.86,61.59 v30.86,60.2 v30.86,47.75 30.86,41.02 30.86,36.07 | 72.35,50 v71.63,49.28 v70.1,49.28 | v24.51,61.59 v23.11,61.59 22.23,62.61
  Bottom 0.254: TP1.TP R24.2
  Bottom 0.406: v34.29,30.99 32.77,30.99 31.24,32.51 v31.24,34.67
  Bottom 1.016: v71.63,49.28 v70.1,49.28 v30.86,49.28 v30.86,47.75 | v30.86,60.2 v30.86,61.59 v24.51,61.59 v23.11,61.59
  pour Top (rank 2, no thermals): 32.38,34.29 32.38,35.05 31.37,35.05 31.37,39.75 30.1,39.75 29.46,39.12 29.46,35.43 28.96,35.43 28.96,34.16 31.37,34.16 31.37,34.29
+5V_DAC
  Top 0.254: C3.1 13.46,64.38 13.46,64.39 13.42,64.35 R26.2 5.63,64.35 TP4.TP
  pour Top (no thermals): 14.86,69.85 16.76,69.85 17.78,68.96 17.78,64.01 16.38,64.01 16,63.37 12.95,63.37 12.95,65.02 14.99,65.02 14.99,67.94 16.26,67.94 16.26,69.6 14.86,69.6
+5V_LCD
  Top 0.305: 77.09,48.26 77.09,48.53 C4.1 | 82.04,48.39 82.04,48.77 TP3.TP | D1.9 76.71,47.62 76.71,48.15 | D1.3 87.63,48.13 84.2,48.13 83.57,48.77 83.57,50.13
  pour Top (rank 2, no thermals): 84.2,51.18 76.71,51.18 76.71,48.13 84.2,48.13
AGND  (via drill 0.25)
  Bottom 0.254: v12.57,65.91 12.57,64.23 LED8.1
  other vias: 13.59,70.74 13.59,71.63 22.73,68.33 23.88,68.33 22.73,67.31 22.73,66.29 23.88,66.29 23.88,67.31 12.57,67.18 13.84,65.91 16.64,60.58 12.06,61.98 13.21,60.58 17.78,60.58 14.35,60.58 15.49,60.58 17.14,61.72 18.29,61.72 19.43,61.72 18.92,62.74 18.92,60.58 12.06,60.58
  pour GND (isolate 0.508): 1.27,81.53 16.26,81.53 16.26,68.83 25.91,68.83 25.91,58.67 7.37,58.67 7.37,63.25 1.27,63.25
  pour Top (no thermals): 14.73,71.25 16,71.25 16,70.87 14.61,70.87 13.97,70.23 13.08,70.23 13.08,72.01 13.97,72.01
  pour Top (no thermals): 20.19,68.71 24.38,68.71 24.38,65.91 20.19,65.91
  pour Top (no thermals): 12.19,67.82 14.48,67.82 14.48,65.53 12.19,65.53
  pour Top (no thermals): 14.48,62.61 11.68,62.61 11.68,60.2 19.81,60.2 19.81,63.12 16.89,63.12 16.89,62.48 16.51,62.1 16.51,61.34 14.48,61.34
BUTTON1  (via drill 0.25)
  Top 0.254: SW3.3 SW3.4 22.73,7.07 R2.2 | IC2.60 76.74,32.23 v77.98,30.99
  Bottom 0.254: SW3.4 25.69,8.54 27.18,10.03 58.04,10.03 64.26,16.26 64.26,21.97 65.91,23.62 66.29,24 69.6,27.3 75.56,27.3 77.98,29.72 v77.98,30.99
BUTTON2  (via drill 0.25)
  Top 0.254: SW4.3 SW4.4 43.05,7.07 R4.2 | IC2.59 77.24,33 v79.5,30.73
  Bottom 0.254: SW4.4 46.01,8.54 46.61,9.14 58.42,9.14 65.41,16.13 65.41,21.97 70.23,26.8 76.71,26.8 79.5,29.59 v79.5,30.73
BUTTON3  (via drill 0.25)
  Top 0.254: SW5.3 SW5.4 | SW5.4 63.37,7.07 R5.2 | SW5.4 66.33,7.53 70.36,11.56 v70.74,11.94 | IC2.62 75.74,31.71 76.58,30.86 76.58,27.56 v73.41,24.38
  Bottom 0.254: v73.41,24.38 73.41,14.61 v70.74,11.94
BUTTON4  (via drill 0.25)
  Top 0.254: SW6.3 SW6.4 | 83.69,7.07 R6.2 86.61,7.11 SW6.4 | IC2.61 76.24,31.97 77.09,31.11 77.09,29.46 v78.87,27.69 | v86.61,19.94 86.61,7.1 SW6.4
  Bottom 0.254: v78.87,27.69 v86.61,19.94
DAC_BCK  (via drill 0.25)
  Top 0.254: IC3.1 16.32,72.96 19.18,75.82 | 19.18,75.82 47.12,75.82 49.15,77.85 v56.13,77.85 | 19.18,75.82 18.54,76.45 TP8.TP | R28.1 67.82,30.99 67.18,31.62 67.18,35.94 56.13,46.99 v56.13,59.69
  Bottom 0.254: v56.13,77.85 v56.13,59.69
DAC_DATA  (via drill 0.25)
  Top 0.254: TP7.TP 14.73,76.71 14.22,76.2 14.22,72.77 14.67,72.33 IC3.2 16.45,72.33 19.18,75.06 47.12,75.06 49.02,76.96 59.82,76.96 61.47,75.31 v84.45,75.31 | R27.2 v90.81,24.77
  Bottom 0.254: v90.81,24.77 90.81,33.91 89.66,35.05 89.66,48.39 84.45,53.59 v84.45,75.31
DAC_LRCK  (via drill 0.25)
  Top 0.254: IC3.3 16.57,71.69 19.05,74.17 v22.35,74.17 46.99,74.17 49.28,76.45 53.34,76.45 54.74,75.06 v57.4,75.06 | R29.1 68.75,35.65 57.4,46.99 v57.4,58.29
  Bottom 0.254: TP6.TP v22.35,74.17 | v57.4,75.06 v57.4,58.29
DAC_SPI_CLK  (via drill 0.25)
  Top 0.254: IC3.14 48.58,71.69 49.4,70.87 v98.93,70.87 | R22.2 88.52,32.26 v92.33,36.07
  Bottom 0.254: v98.93,70.87 98.93,39.62 95.38,36.07 v92.33,36.07
DAC_SPI_DATA
  Top 0.254: IC3.13 48.32,71.06 49.53,69.85 93.6,69.85 98.42,65.02 98.42,40.26 88.9,30.73 R23.2
DAC_ZEROH  (via drill 0.25)
  Top 0.254: IC3.11 48.07,69.79 61.09,56.77 61.09,48.51 63.5,46.1 63.75,45.85 v65.28,44.32 | IC2.4 74.39,31.46 v74.55,31.62
  Bottom 0.254: v74.55,31.62 65.28,40.89 v65.28,44.32
DAC_ZEROL  (via drill 0.25)
  Top 0.254: IC3.12 48.2,70.42 61.72,56.9 61.72,50.16 v68.2,43.56 68.2,43.58 67.07,44.71 | IC2.5 74.07,30.96 74.55,30.48 v75.56,30.48
  Bottom 0.254: v75.56,30.48 75.56,33.53 68.2,40.89 v68.2,43.56
DIS_!CS  (via drill 0.25)
  Top 0.254: IC2.58 77.74,35.67 76.83,36.58 v76.83,42.29 | v86.23,42.29 D1.4
  Bottom 0.254: v76.83,42.29 v86.23,42.29
DIS_SCK
  Top 0.254: D1.6 81.15,42.8 79.76,41.4 R8.1
DIS_SDI  (via drill 0.25)
  Top 0.254: D1.7 78.61,41.66 v78.61,41.4 | v81.28,41.4 R21.1
  Bottom 0.254: v78.61,41.4 v81.28,41.4
ENC_A  (via drill 0.25)
  Top 0.254: R16.1 | R16.1 6.64,19.98 7.49,20.83 29.97,20.83 35.56,15.24 v70.99,15.24 | IC2.12 71.91,27.46 70.99,26.54 v70.99,25.78 | SW2.A R16.1
  Bottom 0.254: v70.99,25.78 v70.99,15.24
ENC_B  (via drill 0.25)
  Top 0.254: R19.1 | v69.72,14.22 34.16,14.22 29.97,18.41 R19.1 | IC2.11 71.52,27.96 69.72,26.16 v69.72,24.77 | SW2.B R19.1
  Bottom 0.254: v69.72,24.77 v69.72,14.22
FLEXR
  pour Bottom (rank 2): 38.4,57.96 37.87,57.95 37.48,57.94 37.38,57.91 37.05,57.82 36.64,57.65 36.12,57.32 35.71,56.99 35.33,56.74 34.96,56.53 34.39,56.31 33.79,56.15 33.29,56.09 12.3,56.09 12.25,56.1 12.22,56.15 12.25,56.18 12.35,56.25 12.45,56.38 12.51,56.55 12.8,58.15 12.43,58.15 12.21,56.69 12.17,56.61 12.08,56.56 12.03,56.55 11.33,58.16 10.96,58.15 11.85,56.1 1.45,56.11 1.45,55.94 11.96,55.94 12.06,55.76 12.21,55.6 12.42,55.51 12.7,55.45 12.89,55.46 12.9,55.78 12.73,55.78 12.48,55.84 12.37,55.94 33.38,55.96 33.9,55.96 34.19,55.99 34.61,56.05 34.94,56.15 35.32,56.3 35.45,56.36 35.7,56.48 36,56.69 36.11,56.76 36.47,57.05 36.95,57.37 37.33,57.57 37.74,57.71 37.98,57.79 38.39,57.82 38.44,57.85 38.4,57.94
  pour Bottom: 37.81,58.16 37.85,58.2 37.85,58.25 37.81,58.31 37.73,58.31 37.15,58.29 37.01,58.28 36.8,58.25 36.49,58.17 36.23,58.05 35.89,57.87 35.49,57.62 35.13,57.34 34.86,57.15 34.65,57 34.27,56.81 33.85,56.64 33.55,56.56 33.32,56.5 33.01,56.46 32.78,56.45 32.7,56.41 32.67,56.38 32.68,56.34 32.72,56.3 32.83,56.29 33.29,56.3 33.79,56.36 34.25,56.45 34.77,56.64 35.18,56.85 35.57,57.12 35.99,57.45 36.28,57.65 36.63,57.84 36.96,57.99 37.39,58.12 37.68,58.16 37.74,58.17
  pour Bottom: 37.17,58.49 37.2,58.51 37.22,58.54 37.22,58.57 37.19,58.61 36.33,58.62 36.2,58.59 35.83,58.47 35.5,58.34 35.19,58.15 34.87,57.94 34.46,57.63 34.18,57.42 33.84,57.23 33.61,57.14 33.36,57.02 33.06,56.93 32.79,56.85 32.33,56.77 32.11,56.76 32.09,56.98 32.33,56.98 32.65,57.04 33.09,57.14 33.41,57.25 33.97,57.52 34.26,57.7 34.59,57.96 34.79,58.15 35.1,58.34 35.39,58.5 35.84,58.69 36.16,58.79 36.33,58.82 36.54,58.83 36.6,58.85 36.63,58.88 36.63,58.93 36.59,58.95 35.78,58.95 35.52,58.9 35.11,58.72 34.74,58.57 34.39,58.32 34,58.04 33.64,57.76 33.07,57.46 32.61,57.29 32.23,57.19 32.05,57.16 31.74,58.88 30.11,58.87 30.16,58.58 31.46,58.59 31.6,57.81 30.65,57.8 30.68,57.53 31.65,57.52 31.7,57.17 31.69,57.12 31.64,57.12 31.56,57.11 31.52,57.09 31.54,57.02 31.57,56.99 31.67,56.97 31.74,56.93 31.86,56.24 32.21,56.25 32.14,56.61 32.41,56.62 32.81,56.64 33.23,56.71 33.65,56.8 34.08,56.96 34.44,57.13 34.84,57.38 35.13,57.59 35.39,57.79 35.61,57.95 35.85,58.08 36.07,58.2 36.37,58.33 36.65,58.43 36.93,58.48
  pour Bottom: 29.63,58.95 29.64,58.95 30.07,56.67 30.07,56.58 30.06,56.5 30.02,56.38 29.96,56.32 29.88,56.27 29.76,56.23 29.64,56.21 29.53,56.2 29.49,56.42 29.6,56.45 29.67,56.48 29.72,56.52 29.75,56.6 29.76,56.69 29.74,56.84 29.31,58.96
  pour Bottom: 28.55,57.92 28.39,58.05 28.21,58.12 27.99,58.16 27.81,58.17 27.62,58.15 27.47,58.09 27.36,58.01 27.27,57.87 27.25,57.73 27.25,57.59 27.3,57.44 27.37,57.33 27.49,57.24 27.59,57.18 27.83,57.09 28.02,57.06 28.2,57.06 28.39,57.09 28.53,57.11 28.57,57.16 28.5,57.35 28.38,57.32 28.14,57.3 27.91,57.33 27.72,57.4 27.6,57.51 27.53,57.62 27.53,57.72 27.57,57.83 27.65,57.89 27.75,57.92 27.82,57.93 27.91,57.92 28.02,57.9 28.1,57.89 28.19,57.85 28.26,57.78 28.39,57.65 28.46,57.56 28.53,57.46 28.63,57.17 28.63,57.08 28.63,56.98 28.63,56.88 28.59,56.76 28.56,56.67 28.49,56.59 28.41,56.53 28.31,56.48 28.2,56.45 28.09,56.44 27.95,56.45 27.86,56.48 27.75,56.55 27.69,56.57 27.72,56.3 27.81,56.27 27.95,56.24 28.07,56.21 28.24,56.2 28.38,56.21 28.48,56.23 28.61,56.28 28.69,56.33 28.78,56.41 28.85,56.53 28.91,56.68 28.94,56.86 28.94,57 28.94,57.17 28.91,57.35 28.87,57.49 28.78,57.66 28.69,57.78 28.63,57.85
  pour Bottom: 26.82,58.15 26.47,58.15 26.16,57.52 26.15,57.5 26.11,57.54 25.63,58.14 25.23,58.15 25.97,57.22 25.95,57.18 25.95,57.16 25.46,56.24 25.86,56.24 26.2,56.92 26.75,56.24 27.12,56.24 26.35,57.22 26.79,58.08
  pour Bottom: 25.13,56.24 24.66,58.86 24.09,58.88 23.88,58.87 23.71,58.86 23.55,58.82 23.39,58.74 23.29,58.64 23.2,58.51 23.16,58.35 23.16,58.26 23.18,58.13 23.23,57.98 23.3,57.85 23.37,57.75 23.48,57.63 23.57,57.57 23.67,57.51 23.77,57.47 23.87,57.44 23.37,56.24 23.74,56.24 24.15,57.38 24.52,57.38 24.49,57.66 24.07,57.64 23.88,57.71 23.7,57.78 23.55,57.93 23.51,58.07 23.5,58.25 23.54,58.38 23.63,58.5 23.71,58.54 23.86,58.59 23.96,58.6 24.08,58.61 24.2,58.6 24.3,58.59 24.36,58.56 24.39,58.53 24.78,56.23 24.96,56.24
  pour Bottom: 22.96,56.93 22.93,57.07 22.92,57.21 22.89,57.34 22.77,57.58 22.66,57.75 22.53,57.9 22.42,58.01 22.22,58.1 22.05,58.15 21.88,58.18 21.69,58.17 21.51,58.15 21.36,58.11 21.2,58.05 21.42,56.95 21.45,56.81 21.46,56.7 21.44,56.54 21.41,56.38 21.36,56.23 21.69,56.24 21.71,56.37 21.72,56.97 21.53,57.85 21.58,57.89 21.67,57.91 21.77,57.94 21.85,57.94 21.91,57.94 21.98,57.94 22.1,57.89 22.21,57.83 22.29,57.76 22.4,57.64 22.47,57.54 22.52,57.44 22.58,57.26 22.6,57.16 22.62,57.04 22.64,56.89 22.63,56.76 22.61,56.64 22.56,56.57 22.49,56.5 22.4,56.46 22.27,56.43 22.16,56.46 22.02,56.52 21.96,56.59 21.89,56.67 21.82,56.76 21.78,56.89 21.8,56.37 21.94,56.28 22.06,56.23 22.18,56.19 22.43,56.2 22.59,56.22 22.71,56.27 22.8,56.38 22.87,56.45 22.9,56.55 22.93,56.67 22.95,56.79
  pour Bottom: 20.92,57.3 20.9,57.43 20.85,57.54 20.76,57.69 20.66,57.82 20.55,57.92 20.43,58.01 20.26,58.1 20.09,58.15 19.88,58.17 19.74,58.16 19.65,58.12 19.57,58.08 19.49,58.02 19.43,57.95 19.25,58.95 18.96,58.94 19.44,56.23 19.75,56.24 19.71,56.38 19.74,56.43 19.79,56.38 19.88,56.31 19.98,56.27 20.19,56.22 20.4,56.2 20.59,56.24 20.7,56.31 20.79,56.39 20.87,56.51 20.92,56.69 20.95,56.81 20.95,56.95 20.94,57.15 20.6,57.15 20.61,57 20.61,56.86 20.58,56.72 20.52,56.61 20.44,56.53 20.33,56.46 20.22,56.44 20.12,56.43 20,56.47 19.91,56.54 19.83,56.61 19.74,56.74 19.65,56.89 19.62,57 19.56,57.27 19.52,57.55 19.52,57.67 19.56,57.75 19.64,57.84 19.75,57.9 19.89,57.92 20.01,57.91 20.1,57.88 20.21,57.82 20.33,57.73 20.41,57.63 20.49,57.51 20.54,57.4 20.59,57.25 20.6,57.2 20.94,57.2
  pour Bottom: 18.73,57.9 18.45,57.91 18.75,56.24 18.45,56.24 18.1,58.15 18.68,58.15 18.7,58.04
  pour Bottom: 18.39,58.56 18.42,58.6 18.43,58.66 18.43,58.74 18.4,58.81 18.33,58.86 18.22,58.89 18.13,58.87 18.07,58.83 18.03,58.76 18.03,58.66 18.05,58.58 18.13,58.52 18.21,58.5 18.28,58.5
  pour Bottom: 17.35,57.92 17.28,57.98 17.19,58.04 17.06,58.12 16.91,58.15 16.76,58.18 16.59,58.18 16.46,58.16 16.31,58.12 16.17,58.04 16.08,57.95 16.01,57.83 15.97,57.69 15.95,57.56 15.95,57.4 15.97,57.25 16,57.08 16.05,56.91 16.12,56.77 16.2,56.62 16.33,56.49 16.46,56.38 16.6,56.27 16.76,56.22 16.92,56.2 17.1,56.2 17.25,56.21 17.41,56.27 17.5,56.34 17.61,56.47 17.69,56.64 17.72,56.79 17.72,57.09 17.69,57.29 17.61,57.54 17.48,57.78 17.11,57.75 17.2,57.63 17.28,57.5 17.35,57.33 17.38,57.2 17.41,57.01 17.4,56.79 17.36,56.65 17.28,56.55 17.2,56.48 17.08,56.44 16.93,56.43 16.77,56.47 16.64,56.54 16.53,56.64 16.45,56.76 16.35,57.01 16.29,57.26 16.28,57.47 16.3,57.66 16.38,57.8 16.5,57.89 16.62,57.92 16.81,57.93 16.96,57.89 17.04,57.83 17.06,57.79 17.46,57.82
  pour Bottom: 14.57,56.32 14.47,56.64 14.38,56.58 14.29,56.53 14.19,56.5 14.04,56.46 13.91,56.46 13.77,56.48 13.63,56.53 13.54,56.61 13.48,56.7 13.46,56.83 13.44,56.95 13.47,57.05 13.53,57.15 13.6,57.24 13.72,57.34 13.85,57.44 14.04,57.59 14.12,57.67 14.24,57.78 14.31,57.92 14.33,58.05 14.34,58.21 14.34,58.32 14.31,58.44 14.24,58.59 14.15,58.69 14,58.79 13.86,58.86 13.72,58.9 13.51,58.92 13.3,58.9 13.1,58.88 13,58.84 13.13,58.52 13.22,58.57 13.35,58.61 13.5,58.63 13.64,58.63 13.76,58.6 13.87,58.54 13.94,58.45 14,58.36 14.01,58.22 14.01,58.08 13.94,57.99 13.6,57.66 13.49,57.59 13.4,57.5 13.32,57.43 13.25,57.34 13.18,57.23 13.14,57.11 13.13,56.94 13.15,56.76 13.19,56.61 13.29,56.44 13.42,56.34 13.54,56.27 13.74,56.21 13.98,56.2 14.19,56.2 14.35,56.24 14.48,56.28
  pour Bottom: 9.62,58.05 9.82,58.12 10.03,58.16 10.13,58.17 10.24,58.17 10.34,58.15 10.45,58.12 10.53,58.08 10.61,58.03 10.68,57.96 10.76,57.87 10.8,57.76 10.83,57.56 10.81,57.45 10.76,57.36 10.67,57.29 10.53,57.19 10.3,57.07 10.17,56.98 10.11,56.9 10.08,56.81 10.08,56.73 10.11,56.65 10.15,56.56 10.26,56.49 10.37,56.46 10.52,56.45 10.64,56.47 10.74,56.52 10.9,56.63 11.06,56.35 10.97,56.3 10.86,56.24 10.73,56.22 10.6,56.21 10.4,56.21 10.24,56.24 10.1,56.29 9.99,56.35 9.86,56.49 9.82,56.56 9.76,56.74 9.76,56.88 9.79,57 9.83,57.09 9.91,57.17 10.05,57.26 10.17,57.32 10.29,57.4 10.41,57.47 10.48,57.56 10.49,57.65 10.48,57.75 10.43,57.82 10.34,57.89 10.23,57.92 10.12,57.93 10,57.91 9.94,57.87 9.77,57.78
  pour Bottom: 9.16,58.15 8.93,58.15 8.85,58.57 8.49,58.69 8.63,58.13 8.08,58.15 8.13,57.93 8.69,57.91 8.72,57.72 8.79,57.36 8.9,56.88 8.92,56.78 8.92,56.71 8.9,56.63 8.86,56.56 8.8,56.5 8.72,56.47 8.62,56.45 8.54,56.46 8.44,56.48 8.34,56.52 8.34,56.26 8.41,56.23 8.55,56.2 8.7,56.2 8.92,56.2 9,56.23 9.08,56.27 9.14,56.35 9.19,56.44 9.21,56.53 9.23,56.65 9.21,56.83 9.19,56.97 8.99,57.91 9.21,57.92 9.19,58.07
  pour Bottom: 7.8,57.18 7.79,57.27 7.75,57.42 7.69,57.54 7.61,57.7 7.5,57.85 7.38,57.96 7.23,58.05 7.1,58.12 6.95,58.16 6.78,58.19 6.64,58.17 6.45,58.16 6.32,58.12 6.22,58.05 6.15,57.94 6.11,57.8 6.1,57.65 6.11,57.54 6.15,57.44 6.22,57.34 6.3,57.26 6.46,57.17 6.6,57.11 6.78,57.07 6.91,57.05 7.11,57.05 7.23,57.07 7.34,57.1 7.41,57.14 7.35,57.36 7.19,57.33 7.01,57.31 6.85,57.32 6.71,57.35 6.57,57.42 6.46,57.5 6.41,57.58 6.4,57.69 6.43,57.81 6.48,57.86 6.54,57.89 6.61,57.9 6.72,57.92 6.83,57.91 6.91,57.89 7,57.86 7.09,57.81 7.16,57.76 7.23,57.68 7.3,57.59 7.35,57.5 7.38,57.44 7.48,57.1 7.48,56.88 7.46,56.78 7.42,56.68 7.35,56.6 7.28,56.54 7.2,56.5 7.11,56.46 7.02,56.45 6.85,56.45 6.75,56.47 6.66,56.51 6.54,56.57 6.57,56.29 6.71,56.24 6.8,56.22 6.94,56.21 7.14,56.2 7.27,56.21 7.4,56.25 7.52,56.3 7.62,56.38 7.68,56.45 7.72,56.53 7.75,56.67 7.79,56.81 7.82,56.97 7.81,57.06
  pour Bottom: 5.87,56.24 5.6,57.69 5.61,57.73 5.61,57.84 5.61,57.96 5.63,58.08 5.63,58.12 5.33,58.19 5.31,58.07 5.31,57.99 5.3,57.93 5.25,58 5.18,58.05 5.07,58.1 4.93,58.14 4.83,58.17 4.71,58.19 4.55,58.17 4.43,58.13 4.32,58.08 4.25,58.01 4.16,57.91 4.06,58 3.93,58.08 3.82,58.13 3.7,58.17 3.52,58.19 3.39,58.17 3.24,58.11 3.16,58.05 3.09,57.96 3.05,57.85 3.04,57.69 3.05,57.62 3.28,56.24 3.61,56.24 3.38,57.38 3.38,57.58 3.4,57.68 3.42,57.77 3.46,57.84 3.52,57.89 3.59,57.91 3.68,57.92 3.77,57.92 3.83,57.91 3.9,57.89 3.98,57.85 4.03,57.81 4.1,57.75 4.14,57.7 4.17,57.64 4.41,56.23 4.74,56.24 4.5,57.52 4.5,57.6 4.5,57.68 4.52,57.77 4.56,57.83 4.6,57.87 4.76,57.91 4.81,57.91 4.9,57.91 4.97,57.89 5.05,57.86 5.11,57.83 5.18,57.78 5.24,57.73 5.28,57.67 5.3,57.61 5.55,56.24
  pour Bottom: 1.43,58.05 1.56,57.77 1.61,57.82 1.67,57.86 1.76,57.9 1.85,57.92 1.92,57.92 2.02,57.93 2.08,57.91 2.15,57.87 2.21,57.82 2.25,57.77 2.28,57.7 2.27,57.63 2.25,57.54 2.21,57.49 2.16,57.44 1.96,57.32 1.78,57.23 1.68,57.16 1.62,57.06 1.57,56.93 1.56,56.84 1.56,56.74 1.59,56.63 1.63,56.53 1.69,56.45 1.77,56.38 1.87,56.31 1.97,56.25 2.08,56.22 2.22,56.2 2.43,56.2 2.54,56.22 2.63,56.25 2.71,56.28 2.85,56.35 2.69,56.62 2.62,56.57 2.51,56.5 2.38,56.45 2.2,56.43 2.09,56.48 1.99,56.53 1.93,56.6 1.88,56.71 1.87,56.84 1.92,56.93 2,57.01 2.11,57.07 2.42,57.26 2.54,57.38 2.58,57.47 2.6,57.56 2.6,57.69 2.57,57.82 2.5,57.91 2.42,58 2.32,58.08 2.2,58.13 2.04,58.18 1.94,58.2 1.84,58.19 1.7,58.16 1.58,58.12
FLEXRADIO
  Bottom 0.102: 1.07,58.19 1.06,58.73 1,58.73 0.9,58.72 0.85,58.7 0.82,58.66 0.8,58.62 0.79,58.57 0.83,58.53 0.84,58.5 0.88,58.47 1.03,58.48
GND  (via drill 0.25)
  Top 0.254: v40.01,27.56 40.01,26.2 R12.1 | IC2.20 76.24,24.8 76.58,25.15 | IC2.25 78.74,24.64 78.23,25.15 | IC2.41 82.3,29.46 | IC2.56 78.74,33.79 79.12,33.4 | R6.1 v80.52,7.11 | R5.1 v60.2,7.11 | R4.1 v39.88,7.11 | R2.1 v19.56,7.11 | IC2.9 74.05,28.96 v74.55,29.59
  Top 0.305: R17.1 33.66,33.78 v33.27,33.4
  Bottom 0.254: v95.12,50.29 LED6.1 | LED3.1 v32.51,62.99 | LED9.1 v11.68,30.35 | LED4.1 v11.68,37.85 | LED2.1 v65.79,9.53 | LED1.1 v91.06,9.53
  other vias: 32.38,33.4 34.16,33.4 30.23,28.45 29.34,28.45 30.23,31.5 29.34,31.5 28.19,32.13 28.32,30.48 28.32,29.46 28.19,33.02 77.22,53.59 77.22,54.61 80.64,52.58 80.64,53.59 80.64,54.61 79.5,54.1 78.36,54.1 78.36,55.12 79.5,55.12 76.2,53.59 76.2,54.61 46.23,32.13 46.23,33.15 46.23,34.16 46.23,35.18 46.23,36.2 46.23,37.21 48.13,32.77 48.13,33.78 48.13,34.8 48.13,35.81 48.13,36.83 49.66,36.83 28.45,65.53 29.72,65.79 29.72,66.67 79.38,33.27 77.85,40.01 78.61,40.01 89.79,28.32 89.79,27.56 96.01,29.46 97.03,29.46 97.92,28.07 97.92,30.86 77.85,19.94 75.95,18.67 76.83,18.67 78.61,18.67 79.5,18.67 67.18,28.83 67.18,28.07 59.44,35.31 60.71,36.58 62.36,36.58 79.38,32.26 82.3,29.21 82.3,30.23 75.56,29.34 76.83,25.15 77.85,25.15 77.34,26.04 81.41,29.72 80.39,32.26 80.64,27.18 82.3,31.5
  pour GND: 0,0 105.41,0 105.41,82.55 17.53,82.55 17.53,70.1 27.43,70.1 27.43,62.99 24.89,62.99 24.89,60.2 27.43,60.2 27.43,57.66 5.84,57.66 5.84,62.23 0,62.23
  pour Top (no thermals): 32.64,31.75 32.64,32.77 31.88,32.77 31.88,34.04 34.54,34.04 34.54,32.77 33.02,32.77 33.02,31.75
  pour Top (no thermals): 30.61,33.4 30.61,28.07 27.81,28.07 27.81,33.4
  pour Top (no thermals): 81.28,51.94 78.11,51.94 78.11,52.07 75.69,52.07 75.69,55.5 81.28,55.5
  pour Top (no thermals): 45.21,29.72 45.21,28.57 46.1,28.57 46.1,29.72 46.86,30.48 46.86,32.26 50.55,32.26 50.55,37.59 43.94,37.59 43.94,31.88 45.59,31.88 45.59,30.1
  pour Top (no thermals): 27.94,67.18 30.1,67.18 30.1,65.66 29.59,65.15 27.94,65.15
  pour Top (no thermals): 73.91,33.78 83.06,33.78 83.06,24.64 73.91,24.64
  pour Top (no thermals): 77.47,40.39 78.99,40.39 78.99,39.62 78.74,39.37 78.74,38.23 77.72,38.23 77.72,39.37 77.47,39.62
  pour Top (no thermals): 88.01,28.45 89.03,28.45 89.53,28.7 90.17,28.7 90.17,27.18 89.53,27.18 89.03,27.43 88.01,27.43
  pour Top (no thermals): 95.63,31.37 98.3,31.37 98.3,27.56 95.63,27.56
  pour Top (no thermals): 75.56,20.45 79.88,20.45 79.88,18.29 75.56,18.29
  pour Top (no thermals): 66.8,29.21 67.69,29.21 67.94,28.96 68.96,28.96 68.96,27.94 67.94,27.94 67.69,27.69 66.8,27.69
  pour Top (no thermals): 62.87,34.8 62.87,36.96 59.05,36.96 59.05,34.8
N$1
  Top 0.254: IC2.31 81.74,24.33 82.17,24.77 R27.1
N$2
  Top 0.254: C10.1 43.4,23.14 R10.1 43.5,24.74 IC4.4 41.99,26.41 R12.2
N$3
  Top 0.254: IC2.55 79.24,35.67 79.76,36.2 R8.2
N$4  (via drill 0.25)
  other vias: 44.2,30.35 44.83,30.35 44.83,30.99 44.2,30.99 48.01,28.19 47.12,28.19 47.12,29.21 48.01,29.21 48.01,30.23
  pour Top (rank 3, no thermals): 44.07,28.83 44.83,28.83 44.83,29.72 45.21,30.23 45.21,31.37 43.81,31.37 43.81,30.1 44.07,29.72
  pour Bottom (rank 3, no thermals): 43.81,31.37 47.5,31.37 48.39,30.48 48.39,27.69 46.61,27.69 46.61,29.84 43.81,29.84
  pour Top (rank 3, no thermals): 46.61,27.69 47.62,27.69 48.39,26.92 48.39,25.91 50.42,25.91 50.42,31.75 47.37,31.75 47.37,30.35 46.61,29.59
N$5
  Top 0.305: IC4.6 C9.2
N$6
  Top 0.254: IC4.5 44.45,27.18 44.07,27.56 41.82,27.56 R3.1
N$7
  Top 0.406: IC1.7 32.82,37.45 L1.1
  pour Top (rank 3, no thermals): 32.26,39.88 33.15,39.88 33.91,39.12 33.91,36.58 33.02,35.69 33.02,35.18 32.51,35.18 32.26,35.43
N$8
  Top 0.254: IC1.5 34.12,34.67 C21.2 R15.1 R17.2
N$9
  Top 0.254: IC6.3 16.82,63.56 15.88,62.61 15.88,62.5 C2.2
N$10
  Top 0.254: IC2.53 80.24,35.66 80.9,36.32 80.9,36.62 R21.2
N$11
  Top 0.254: IC2.30 81.24,19.48 82.8,17.91 R11.1
N$12  (via drill 0.25)
  Top 0.254: v82.8,9.53 R11.2
  Bottom 0.254: LED1.2 v82.8,9.53
N$13  (via drill 0.25)
  Top 0.254: v40.01,62.99 41.57,62.99 R31.1
  Bottom 0.254: LED3.2 v40.01,62.99
N$14
  Top 0.254: IC2.46 85.05,31.96 85.6,32.51 R20.1
N$15  (via drill 0.25)
  Top 0.254: R9.2 v72.39,9.53
  Bottom 0.254: LED2.2 v72.39,9.53
N$16  (via drill 0.25)
  Top 0.254: CN1.5 v68.83,19.68 | v68.83,23.5 74.72,23.5 IC2.17
  Bottom 0.254: v68.83,19.68 v68.83,23.5
N$17
  Top 0.254: IC2.29 R9.1
N$18
  Top 0.254: C13.1 64.12,33.55 R7.2 65.11,33.53 R1.1
N$19
  Top 0.305: IC3.10 19.88,69.15 19.05,68.33 19.05,67.04 C18.1
N$20
  Top 0.254: IC2.3 71.93,31.96 71.37,32.51 R29.2
N$21
  Top 0.254: IC2.44 85.06,30.96 86.49,32.38 86.65,32.13 R22.1
N$22
  Bottom 0.254: 15.15,35.95 R24.1 LED4.2
N$23
  Top 0.305: IC7.3 76.4,51.63 75.56,50.8 75.56,48.78 C4.2
N$24  (via drill 0.6)
  Top 0.254: R25.1 v89.66,50.29
  Bottom 0.254: v89.66,50.29 LED6.2
N$25
  Top 0.254: IC2.18 75.24,22.53 74.93,22.23 CN1.4
N$26  (via drill 0.25)
  Top 0.254: R26.1 v10.63,62.65
  Bottom 0.254: v10.63,62.65 10.63,63.89 LED8.2
N$27
  Top 0.254: IC2.43 85.45,30.46 85.72,30.73 R23.1
N$28
  Bottom 0.254: R30.1 LED9.2
N$29
  Bottom 1.016: SW1.1 46.79,67.39 50.47,63.7 BH1.POS
N$30
  Top 1.016: J3.2 15.29,48.9 SW1.3
N$31
  Top 0.254: IC2.6 71.9,30.46 71.37,30.99 R28.2
N$194
  Bottom 0.102: 0.73,58.18 0.9,58.43
N$195
  Bottom 0.152: 15.83,55.53 15.88,55.54 15.97,55.55 16.03,55.54 16.1,55.5 16.15,55.44 16.17,55.37 16.18,55.29 16.14,55.21 16.08,55.16 16.01,55.09 15.93,55.02 15.89,54.95 15.88,54.86 15.89,54.79 15.94,54.72 16.01,54.69 16.09,54.67 16.17,54.67 16.24,54.67 16.28,54.69
N$197
  Bottom 0.152: 15.41,55.26 15.32,55.28 15.23,55.27 15.16,55.23 15.12,55.19 15.11,55.12 15.11,55.06 15.12,54.98 15.14,54.91 15.15,54.86 15.19,54.78 15.25,54.73 15.32,54.69 15.4,54.67 15.47,54.67 15.52,54.67 15.56,54.71 15.58,54.75 15.61,54.82 15.62,54.89 15.62,54.95 15.62,55.01 15.58,55.09 15.54,55.15 15.51,55.19
N$198
  Bottom 0.102: 14.54,55.28 14.85,55.26 14.74,55.26 14.73,55.28
  Bottom 0.152: 15.01,54.4 14.96,54.43 14.9,54.46 14.88,54.51 14.86,54.58 14.83,54.67 14.81,54.76 14.8,54.87 14.73,55.28 14.72,55.35 14.69,55.43 14.66,55.49 14.6,55.54 14.5,55.56 14.47,55.56
N$202
  Bottom 0.102: 14.12,55.49 14.13,55.46 14.16,55.44 | 13.99,55.28 14.31,55.27 14.24,55.27 14.21,55.3
  Bottom 0.127: 14.16,55.44 14.18,55.41 14.19,55.39 | 14.26,54.7 14.22,54.67 14.17,54.65 14.05,54.67
  Bottom 0.152: 14.19,55.39 14.19,55.38 14.21,55.3 14.23,55.19 14.27,54.93 14.29,54.82 14.29,54.74 14.26,54.7
N$205
  Bottom 0.102: 13.66,54.7 | 13.68,54.72 13.66,54.7 | 13.37,55.21 13.37,55.19 13.41,55.16 | 13.23,54.71 13.23,54.72
  Bottom 0.152: 13.23,54.71 13.37,55.21 | 13.23,54.72 12.94,55.27 | 13.68,54.72 13.41,55.16 13.36,55.23 | 13.66,54.7 13.77,55.25
N$207
  Bottom 0.102: 12.45,54.72 12.5,54.69 12.56,54.68 12.65,54.66 12.68,54.67 | 12.79,54.86 12.79,54.91 12.8,54.92
  Bottom 0.127: 12.77,55.02 12.74,55.1 12.69,55.16 12.64,55.22 12.57,55.25 12.46,55.28 12.36,55.27 12.29,55.25 12.37,54.84 12.37,54.74 12.36,54.69 12.34,54.66 | 12.39,54.83 12.41,54.77 12.45,54.72 | 12.68,54.67 12.72,54.69 12.76,54.7
  Bottom 0.152: 12.81,54.88 12.8,54.92 12.79,54.95 12.77,55.02 | 12.76,54.7 12.79,54.74 12.79,54.81 12.79,54.86
N$209
  Bottom 0.102: 11.9,55.19 11.93,55.17 | 11.9,55.19 11.87,55.22 11.83,55.25 11.79,55.27 | 11.9,55.19 11.96,55.19 11.97,55.18
  Bottom 0.127: 11.79,55.27 11.75,55.27 11.67,55.28
  Bottom 0.152: 12.07,54.68 11.97,55.18 11.96,55.22 11.96,55.25
N$211
  Bottom 0.102: 11.15,54.69 11.19,54.68 11.27,54.67 11.29,54.66 | 11.37,55.21 11.3,55.25 11.26,55.26 11.21,55.28 11.15,55.28 11.1,55.27 11.04,55.25 | 11.27,54.98 11.37,54.98 11.4,54.99
  Bottom 0.127: 11.29,54.66 11.33,54.67 11.39,54.69 11.45,54.74 | 11.46,55.1 11.4,55.17 11.37,55.21 | 11.04,55.25 11.02,55.21 11.02,55.1 11.04,55.06 11.07,55.05 11.11,55.02 11.19,54.98 11.27,54.98
  Bottom 0.152: 11.45,54.74 11.49,54.79 11.5,54.87 11.49,54.96 11.47,55.04 11.46,55.1
N$214
  Bottom 0.102: 10.24,55.52 10.22,55.52 10.2,55.54 | 9.8,55.37 9.8,55.36 9.79,55.35
  Bottom 0.127: 9.79,55.05 9.82,54.95 9.86,54.88 9.89,54.81 9.94,54.77 10.03,54.72 10.11,54.69 10.22,54.67 10.32,54.69 | 10.2,55.54 10.07,55.54 9.99,55.53 9.93,55.51 9.89,55.49 9.85,55.44 9.8,55.37
  Bottom 0.152: 9.8,55.38 9.79,55.35 9.78,55.28 9.77,55.17 9.79,55.05 | 10.39,54.69 10.24,55.52
N$215
  Bottom 0.102: 9.18,54.7 9.21,54.68 9.25,54.67 9.3,54.66 | 9.29,55.27 9.23,55.28 9.17,55.28 9.12,55.26 | 9.23,54.98 9.31,54.98 9.37,54.97 9.4,54.98 9.46,54.99
  Bottom 0.127: 9.3,54.66 9.35,54.66 9.39,54.67 9.45,54.7 9.5,54.74 | 9.47,55.14 9.4,55.23 9.35,55.25 9.29,55.27 | 9.12,55.26 9.09,55.24 9.05,55.18 9.05,55.13 9.05,55.07 9.1,55.04 9.14,55.02 9.2,54.98 9.23,54.98
  Bottom 0.152: 9.5,54.74 9.54,54.81 9.54,54.9 9.53,54.98 9.51,55.09 9.47,55.14
N$217
  Bottom 0.102: 8.47,55.28 8.79,55.27 8.69,55.27 8.67,55.25
  Bottom 0.152: 8.94,54.4 8.89,54.44 8.83,54.48 8.78,54.59 8.76,54.69 8.75,54.8 8.71,54.97 8.69,55.1 8.67,55.25 8.66,55.36 8.64,55.43 8.6,55.48 8.56,55.52 8.52,55.54 8.48,55.56 8.44,55.57 8.42,55.57
N$218
  Bottom 0.127: 8.26,54.67 8.14,55.28 8.25,55.28
N$219
  Bottom 0.178: 8.12,55.51 8.12,55.52
N$221
  Bottom 0.102: 7.63,55.26 7.66,55.24 7.69,55.22 7.72,55.19 7.75,55.19 7.8,55.14
  Bottom 0.127: 7.63,55.26 7.59,55.27 7.53,55.28 7.45,55.26 7.38,55.21 7.37,55.17 7.38,55.08 7.46,54.66 | 7.88,54.67 7.89,54.66 7.8,55.14 7.79,55.2 7.8,55.26
N$224
  Bottom 0.102: 6.78,54.7 6.8,54.69 6.85,54.67 6.92,54.67 | 6.99,55.22 6.93,55.26 6.9,55.28 6.83,55.29 6.76,55.28 6.71,55.27 | 6.89,54.98 7,54.98 7.03,55
  Bottom 0.127: 6.92,54.67 6.93,54.67 6.98,54.68 7.02,54.7 7.07,54.74 | 7.07,55.1 7.03,55.17 6.99,55.22 | 6.71,55.27 6.66,55.25 6.65,55.22 6.64,55.16 6.63,55.11 6.66,55.06 6.71,55.03 6.76,55 6.81,54.98 6.89,54.98
  Bottom 0.152: 7.07,54.74 7.11,54.8 7.12,54.88 7.12,54.97 7.1,55.05 7.07,55.1
N$230
  Bottom 0.102: 6.06,54.71 6.01,54.78 | 6.06,54.71 6.1,54.69 6.15,54.67 6.22,54.66 6.27,54.66 | 6.1,55.28 6.06,55.28 6.02,55.25 6,55.23 5.97,55.2 5.96,55.19 | 6.06,54.71 6.04,54.71 5.99,54.66
  Bottom 0.127: 6.27,54.66 6.32,54.67 6.36,54.7 6.41,54.78 | 6.38,55.13 6.28,55.21 6.24,55.26 6.13,55.28 6.1,55.28
  Bottom 0.152: 5.99,54.66 5.83,55.56 | 6.41,54.78 6.43,54.85 6.41,54.95 6.39,55.05 6.38,55.13
N$233
  Bottom 0.102: 4.94,55.06 4.94,55.07 4.91,55.1 | 5.09,55.52 5.11,55.52 5.12,55.54
  Bottom 0.127: 5.09,55.52 4.87,55.52 4.8,55.51 4.75,55.49 | 4.69,55.36 4.71,55.26 4.74,55.21 4.78,55.17 4.85,55.12 4.91,55.1 5,55.09 5.14,55.1 | 4.76,54.65 4.94,55.06
  Bottom 0.152: 4.75,55.49 4.71,55.45 4.69,55.4 4.69,55.36 | 5.12,55.54 5.26,54.67
N$236
  Bottom 0.102: 4.13,54.72 4.18,54.7 4.25,54.67 4.32,54.67 4.36,54.67 | 4.1,54.77 4.06,54.77 4.05,54.79
  Bottom 0.127: 3.98,55.25 4.05,54.88 4.05,54.79 4.05,54.76 4.04,54.71 4.03,54.67 | 4.08,54.82 4.1,54.77 4.13,54.72 | 4.36,54.67 4.42,54.7 4.46,54.73 | 4.45,55.05 4.39,55.14 4.35,55.21 4.29,55.24 4.23,55.27 4.11,55.29 4.02,55.28
  Bottom 0.152: 4.46,54.73 4.48,54.81 4.48,54.84 4.49,54.91 4.48,54.98 4.45,55.05
N$240
  Bottom 0.102: 3.26,55.11 3.28,55.16 3.3,55.21 3.35,55.25 3.42,55.27 3.48,55.28 | 3.77,54.79 3.77,54.88 | 3.68,54.68 3.63,54.66 3.56,54.65 3.51,54.67 3.47,54.69 3.38,54.75 | 3.38,54.75 3.33,54.82 | 3.38,54.75 3.34,54.75 3.31,54.77
  Bottom 0.127: 3.48,55.28 3.5,55.27 3.59,55.25 3.64,55.21 | 3.77,54.79 3.77,54.78 3.71,54.72 3.68,54.68
  Bottom 0.152: 3.33,54.66 3.31,54.77 3.17,55.54 | 3.64,55.21 3.7,55.14 3.72,55.07 3.74,55.02 3.77,54.94 3.77,54.88
N$242
  Bottom 0.102: 2.86,55.26
  Bottom 0.127: 2.86,55.26 2.99,55.26
  Bottom 0.152: 2.97,54.67 2.86,55.26
N$250
  Bottom 0.178: 2.85,55.51 2.84,55.51
N$255
  Bottom 0.102: 2.62,54.88 2.62,54.86
  Bottom 0.152: 2.6,55 2.59,55.03 2.52,55.16 2.46,55.22 2.39,55.25 2.32,55.26 2.27,55.26 2.18,55.24 2.13,55.2 2.1,55.12 2.1,55.06 2.12,54.95 2.13,54.87 2.17,54.77 2.22,54.73 2.27,54.68 2.34,54.65 2.43,54.65 2.52,54.66 2.55,54.7 2.58,54.75 2.6,54.8 2.62,54.86 | 2.62,54.88 2.62,54.91 2.61,54.97
N$258
  Bottom 0.102: 1.9,54.69 1.82,54.67 1.77,54.66 1.71,54.67 | 1.78,55.26 1.73,55.27 1.68,55.28 1.63,55.27 1.57,55.26 1.54,55.25
  Bottom 0.127: 1.9,54.69 1.94,54.7 | 1.71,54.67 1.65,54.7 1.61,54.75 1.59,54.81 1.59,54.88 1.63,54.93 1.69,54.97 1.75,55 1.8,55.05 1.84,55.09 1.85,55.16 1.83,55.21 1.78,55.26
OSCI
  Top 0.254: IC2.39 85.36,28.46 86.11,29.21 90.68,29.21 92.2,27.69 92.72,27.69 Y1.2 93.23,27.18 93.73,27.18 94.6,26.3 C14.1
OSCO
  Top 0.254: IC2.40 85.09,28.96 85.85,29.72 90.68,29.72 92.2,31.24 92.72,31.24 Y1.1 93.23,31.75 93.73,31.75 94.6,32.62 C15.1
PWRGOOD  (via drill 0.25)
  Top 0.254: IC1.6 33.47,35.25 v34.54,36.2 R18.1
  Bottom 0.254: v34.54,36.2 28.32,36.2 24.77,39.75 TP10.TP
SIGNAL_L
  Top 0.305: IC3.7 12.76,69.15 11.3,70.61 11.3,77.09 10.03,78.36 8.11,78.36 J1.5
SIGNAL_R
  Top 0.305: IC3.8 8.18,68.52 J1.2
SUPPLY
  Top 0.254: R31.2 39.28,64.6 38.48,65.41
  Top 0.406: IC1.3 33.47,30.04 33.4,29.97
  Top 0.61: R3.2 41.19,29.3 | 42.04,29.97 33.4,29.97 C19.1
  Top 1.016: SW1.2 38.48,65.41 38.48,40.01 41.91,36.58 42.56,36.58 C8.2
  Bottom 0.254: SW1.2 38.48,69.34 29.97,77.85 TP5.TP
  pour Top (rank 2, no thermals): 31.11,29.21 31.11,32.51 32.38,32.51 32.38,31.11 33.27,31.11 33.27,32.38 33.66,32.38 33.66,29.21
  pour Top (rank 2, no thermals): 43.69,29.59 43.69,28.83 41.02,28.83 41.02,37.59 43.31,37.59 43.31,29.97
SYS_CLK  (via drill 0.25)
  Top 0.254: IC3.16 24.07,72.96 24.38,73.28 v26.16,73.28 46.86,73.28 49.53,75.95 53.09,75.95 54.86,74.17 67.44,74.17 67.94,74.17 v83.57,74.17 | R20.2 85.69,36.16 v88.65,39.12
  Bottom 0.254: v26.16,73.28 TP9.TP | v88.65,39.12 88.65,47.88 83.57,52.96 v83.57,74.17
TRIGGER  (via drill 0.25)
  Top 0.254: v63.63,42.16 65.53,42.16 72.77,34.92 72.77,32.98 IC2.1
  Bottom 0.254: v63.63,42.16 48.77,42.16 34.29,27.69 28.45,27.69 27.56,28.57 11.3,28.57 9.02,30.86 J2.2
UART-RX  (via drill 0.25)
  Top 0.254: R13.1 49.15,56.9 45.59,60.45 X1.1 | IC2.50 81.74,33.96 v82.3,33.4 | v68.83,51.82 v68.83,46.86
  Bottom 0.254: v82.3,33.4 69.47,46.23 v68.83,46.86 | X1.1 47.37,60.45 56.01,51.82 v68.83,51.82
UART-TX  (via drill 0.25)
  Top 0.254: IC2.51 81.24,33.74 v80.9,33.4 | R14.1 47.54,54.83 46.99,55.37 X1.3 | v67.69,50.93 v67.69,46.61
  Bottom 0.254: X1.3 51.05,55.37 55.5,50.93 v67.69,50.93 | v80.9,33.4 v67.69,46.61
(copper drawn outside any net)
  shapes: Bottom area x829, Bottom circle x1

### Text on the board
tNames: DATA | BCK | LR | SYS | Supply | 5V | 5V | PG | 5V5 | 3v3
bNames: DATA | BCK | LR | SYS | Supply | 5V | DAC LDO Out | Supply | 5V | LCD LDO Out | 5V SW Out | PG | 5V5 | 3v3 | 3.3V SW Out | Line = On | 1 kHz = On | Line / Mic | Freq Step